# EAGLE design light_controller (EAGLE 8.5.0)
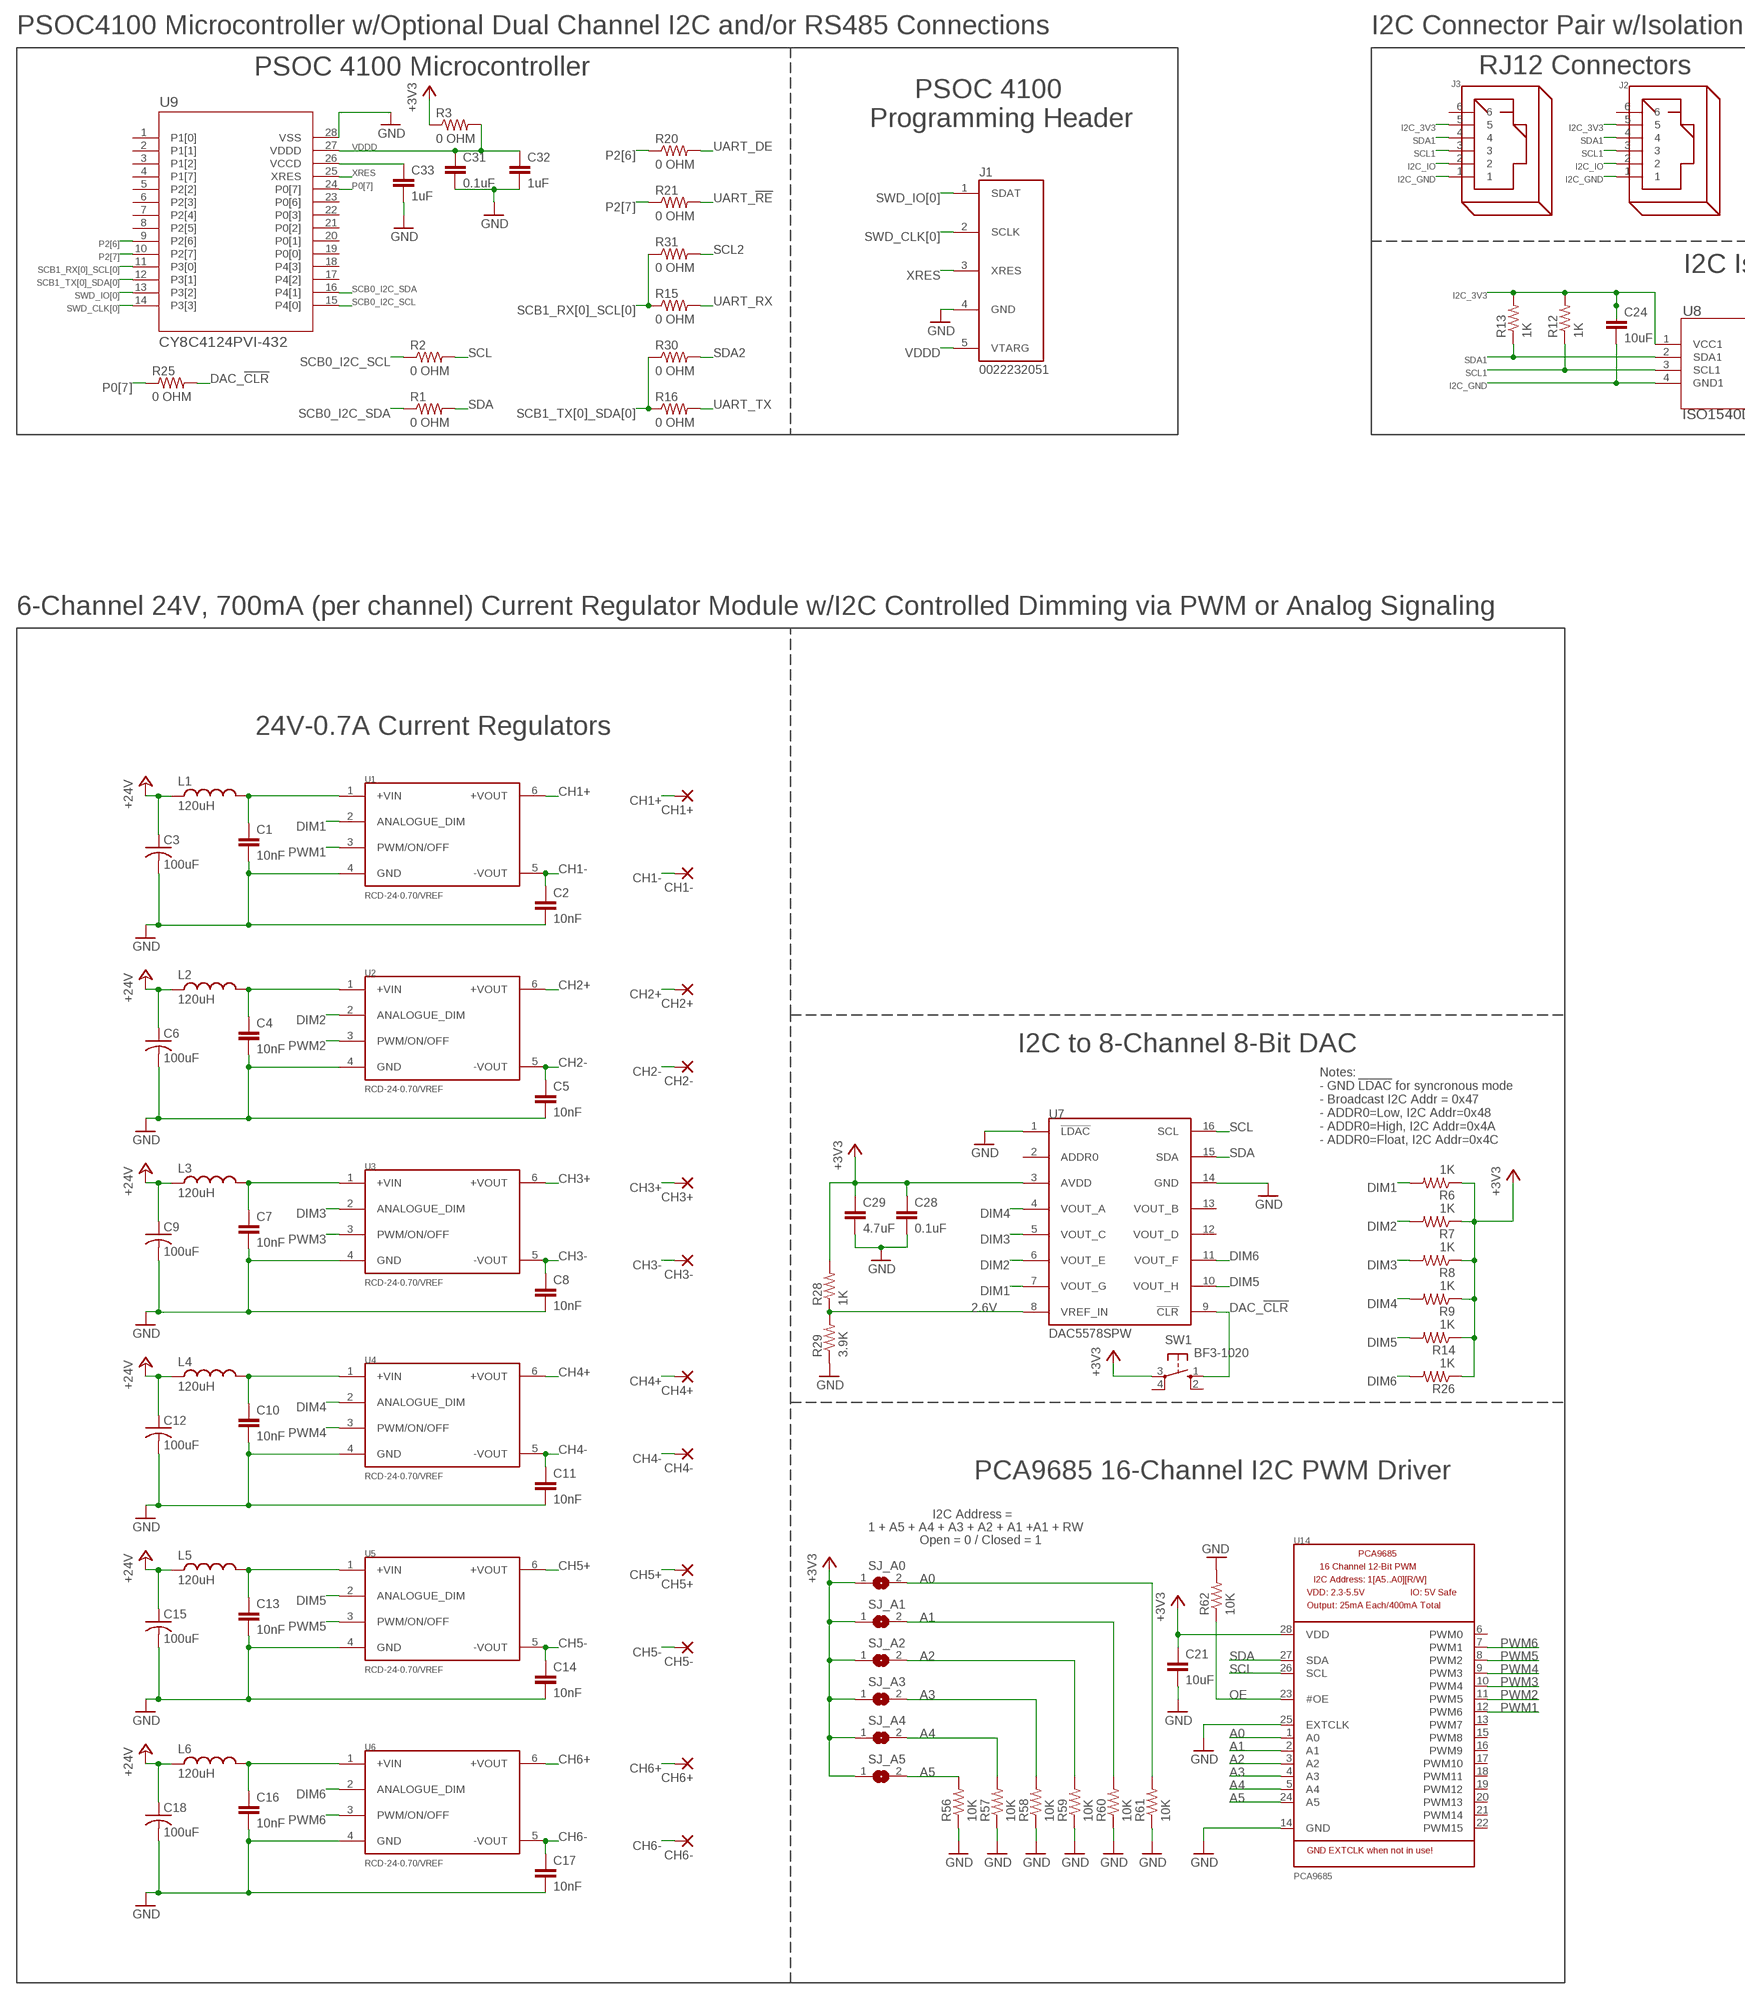
[diagram p0: schematic, sheet 1, part 1 of 2]
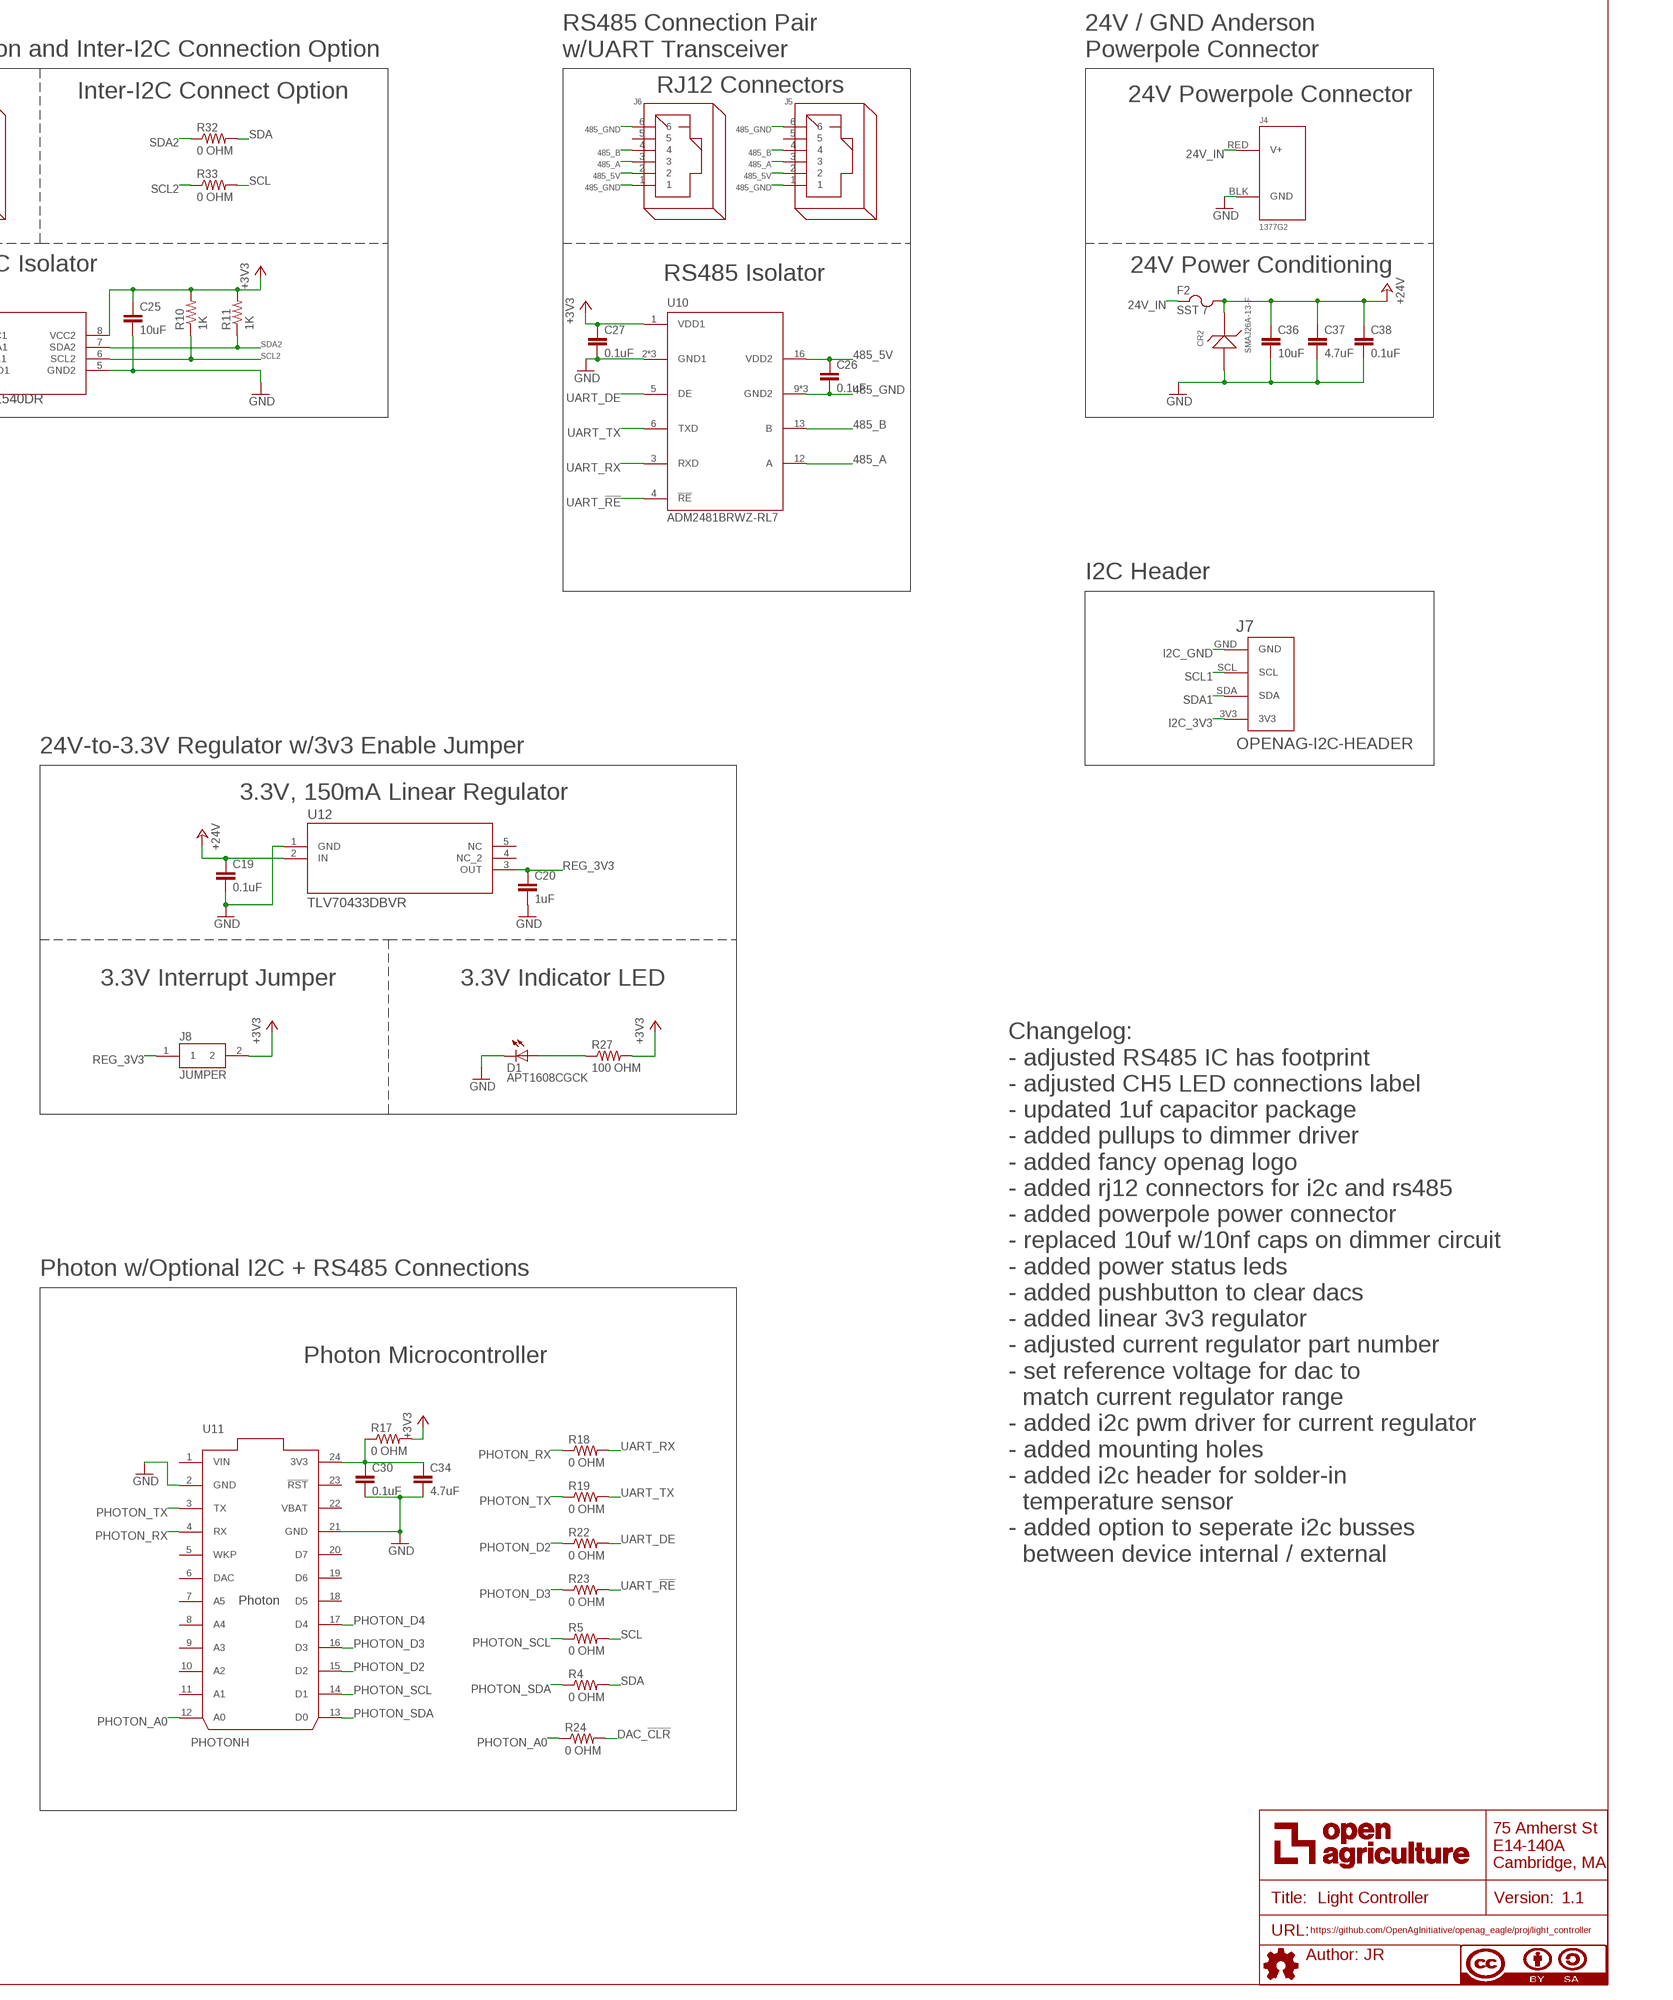
[diagram p1: schematic, sheet 1, part 2 of 2]

## Parts
C1  10nF  10NF-C0603C103K5RACTU  [C0603]
C2  10nF  10NF-C0603C103K5RACTU  [C0603]
C3  100uF  100UF-EEE-1HA101UP  [EEE-1HA101UP]
C4  10nF  10NF-C0603C103K5RACTU  [C0603]
C5  10nF  10NF-C0603C103K5RACTU  [C0603]
C6  100uF  100UF-EEE-1HA101UP  [EEE-1HA101UP]
C7  10nF  10NF-C0603C103K5RACTU  [C0603]
C8  10nF  10NF-C0603C103K5RACTU  [C0603]
C9  100uF  100UF-EEE-1HA101UP  [EEE-1HA101UP]
C10  10nF  10NF-C0603C103K5RACTU  [C0603]
C11  10nF  10NF-C0603C103K5RACTU  [C0603]
C12  100uF  100UF-EEE-1HA101UP  [EEE-1HA101UP]
C13  10nF  10NF-C0603C103K5RACTU  [C0603]
C14  10nF  10NF-C0603C103K5RACTU  [C0603]
C15  100uF  100UF-EEE-1HA101UP  [EEE-1HA101UP]
C16  10nF  10NF-C0603C103K5RACTU  [C0603]
C17  10nF  10NF-C0603C103K5RACTU  [C0603]
C18  100uF  100UF-EEE-1HA101UP  [EEE-1HA101UP]
C19  0.1uF  0.1UF-C0603C104K5RACTU  [C0603]
C20  1uF  1UF-CL10A105KB8NNNC  [C0603]
C21  10uF  10UF-GMK212BBJ106KG-T  [C0805]
C24  10uF  10UF-GMK212BBJ106KG-T  [C0805]
C25  10uF  10UF-GMK212BBJ106KG-T  [C0805]
C26  0.1uF  0.1UF-C0603C104K5RACTU  [C0603]
C27  0.1uF  0.1UF-C0603C104K5RACTU  [C0603]
C28  0.1uF  0.1UF-C0603C104K5RACTU  [C0603]
C29  4.7uF  4.7UF-CL21A475KBQNNNE  [C0805]
C30  0.1uF  0.1UF-C0603C104K5RACTU  [C0603]
C31  0.1uF  0.1UF-C0603C104K5RACTU  [C0603]
C32  1uF  1UF-CL10A105KB8NNNC  [C0603]
C33  1uF  1UF-CL10A105KB8NNNC  [C0603]
C34  4.7uF  4.7UF-CL21A475KBQNNNE  [C0805]
C36  10uF  10UF-GMK212BBJ106KG-T  [C0805]
C37  4.7uF  4.7UF-CL21A475KBQNNNE  [C0805]
C38  0.1uF  0.1UF-C0603C104K5RACTU  [C0603]
CH1+  3,17/1,3  [3,17/1,3]
CH1-  3,17/1,3  [3,17/1,3]
CH2+  3,17/1,3  [3,17/1,3]
CH2-  3,17/1,3  [3,17/1,3]
CH3+  3,17/1,3  [3,17/1,3]
CH3-  3,17/1,3  [3,17/1,3]
CH4+  3,17/1,3  [3,17/1,3]
CH4-  3,17/1,3  [3,17/1,3]
CH5+  3,17/1,3  [3,17/1,3]
CH5-  3,17/1,3  [3,17/1,3]
CH6+  3,17/1,3  [3,17/1,3]
CH6-  3,17/1,3  [3,17/1,3]
CR2  SMAJ26A-13-F  [SMA]
D1  APT1608CGCK  [CHIPLED_0603]
F2  SST 7  SST_7  [SS]
FRAME1  DOCFIELD  [DOCFIELD]
J1  0022232051  MINI-PROG3-5POS-MATING-CONNECTOR  [22-23-2051]
J2  OPENAG-I2C-RJ12  [OPENAG-I2C-RJ12]
J3  OPENAG-I2C-RJ12  [OPENAG-I2C-RJ12]
J4  1377G2  1377G21377G2  [1377G2]
J5  OPENAG-RS485-RJ12  [OPENAG-RS485-RJ12]
J6  OPENAG-RS485-RJ12  [OPENAG-RS485-RJ12]
J7  OPENAG-I2C-HEADER  [OPENAG-I2C-HEADER]
J8  JUMPER  100-MIL-HEADER-JUMPER  [1X2-100-MIL-HEADER]
L1  120uH  120UH-74404064121  [74404064121]
L2  120uH  120UH-74404064121  [74404064121]
L3  120uH  120UH-74404064121  [74404064121]
L4  120uH  120UH-74404064121  [74404064121]
L5  120uH  120UH-74404064121  [74404064121]
L6  120uH  120UH-74404064121  [74404064121]
R1  0 OHM  0OHM-RC0603JR-070RL  [RC0603N]
R2  0 OHM  0OHM-RC0603JR-070RL  [RC0603N]
R3  0 OHM  0OHM-RC0603JR-070RL  [RC0603N]
R4  0 OHM  0OHM-RC0603JR-070RL  [RC0603N]
R5  0 OHM  0OHM-RC0603JR-070RL  [RC0603N]
R6  1K  1K-ERJ-PB3D1001V  [RC0603N]
R7  1K  1K-ERJ-PB3D1001V  [RC0603N]
R8  1K  1K-ERJ-PB3D1001V  [RC0603N]
R9  1K  1K-ERJ-PB3D1001V  [RC0603N]
R10  1K  1K-ERJ-PB3D1001V  [RC0603N]
R11  1K  1K-ERJ-PB3D1001V  [RC0603N]
R12  1K  1K-ERJ-PB3D1001V  [RC0603N]
R13  1K  1K-ERJ-PB3D1001V  [RC0603N]
R14  1K  1K-ERJ-PB3D1001V  [RC0603N]
R15  0 OHM  0OHM-RC0603JR-070RL  [RC0603N]
R16  0 OHM  0OHM-RC0603JR-070RL  [RC0603N]
R17  0 OHM  0OHM-RC0603JR-070RL  [RC0603N]
R18  0 OHM  0OHM-RC0603JR-070RL  [RC0603N]
R19  0 OHM  0OHM-RC0603JR-070RL  [RC0603N]
R20  0 OHM  0OHM-RC0603JR-070RL  [RC0603N]
R21  0 OHM  0OHM-RC0603JR-070RL  [RC0603N]
R22  0 OHM  0OHM-RC0603JR-070RL  [RC0603N]
R23  0 OHM  0OHM-RC0603JR-070RL  [RC0603N]
R24  0 OHM  0OHM-RC0603JR-070RL  [RC0603N]
R25  0 OHM  0OHM-RC0603JR-070RL  [RC0603N]
R26  1K  1K-ERJ-PB3D1001V  [RC0603N]
R27  100 OHM  100OHM-RC0603JR-07100RL  [RC0603N]
R28  1K  1K-ERJ-PB3D1001V  [RC0603N]
R29  3.9K  3.9K-RC0603JR-073K9L  [RC0603N]
R30  0 OHM  0OHM-RC0603JR-070RL  [RC0603N]
R31  0 OHM  0OHM-RC0603JR-070RL  [RC0603N]
R32  0 OHM  0OHM-RC0603JR-070RL  [RC0603N]
R33  0 OHM  0OHM-RC0603JR-070RL  [RC0603N]
R56  10K  10K-ERJ-3EKF1002V  [RC0603N]
R57  10K  10K-ERJ-3EKF1002V  [RC0603N]
R58  10K  10K-ERJ-3EKF1002V  [RC0603N]
R59  10K  10K-ERJ-3EKF1002V  [RC0603N]
R60  10K  10K-ERJ-3EKF1002V  [RC0603N]
R61  10K  10K-ERJ-3EKF1002V  [RC0603N]
R62  10K  10K-ERJ-3EKF1002V  [RC0603N]
SJ_A0  SOLDERJUMPERREFLOW_NOPASTE  [SOLDERJUMPER_REFLOW_NOPASTE]
SJ_A1  SOLDERJUMPERREFLOW_NOPASTE  [SOLDERJUMPER_REFLOW_NOPASTE]
SJ_A2  SOLDERJUMPERREFLOW_NOPASTE  [SOLDERJUMPER_REFLOW_NOPASTE]
SJ_A3  SOLDERJUMPERREFLOW_NOPASTE  [SOLDERJUMPER_REFLOW_NOPASTE]
SJ_A4  SOLDERJUMPERREFLOW_NOPASTE  [SOLDERJUMPER_REFLOW_NOPASTE]
SJ_A5  SOLDERJUMPERREFLOW_NOPASTE  [SOLDERJUMPER_REFLOW_NOPASTE]
SW1  BF3-1020  [B3F-10XX]
U1  RCD-24-0.70/VREF  [RCD-24-PINNED]
U2  RCD-24-0.70/VREF  [RCD-24-PINNED]
U3  RCD-24-0.70/VREF  [RCD-24-PINNED]
U4  RCD-24-0.70/VREF  [RCD-24-PINNED]
U5  RCD-24-0.70/VREF  [RCD-24-PINNED]
U6  RCD-24-0.70/VREF  [RCD-24-PINNED]
U7  DAC5578SPW  [TSSOP16]
U8  ISO1540DR  [D8]
U9  CY8C4124PVI-432  [SSOP-28]
U10  ADM2481BRWZ-RL7  [SOIC16LWB]
U11  PHOTONH  PHOTONHPHOTONH  [PHOTON]
U12  TLV70433DBVR  TLV70433DBVRDBV5-M  [DBV5-M]
U14  PCA9685  PCA9685PW/Q900,118  [TSSOP28]

## Nets
2.6V: R28.1 R29.2 U7.8(VREF_IN)
24V_IN: F2.1 J4.RED(V+)
485_5V: C26.1 J5.2 J6.2 U10.16(VDD2)
485_A: J5.3 J6.3 U10.12(A)
485_B: J5.4 J6.4 U10.13(B)
485_GND: C26.2 J5.1 J5.6 J6.1 J6.6 U10.9(GND2) U10.10(GND2) U10.15(GND2)
+3V3: C21.1 C25.1 C27.1 C28.1 C29.1 J8.2 R3.1 R6.1 R7.1 R8.1 R9.1 R10.2 R11.2 R14.1 R17.2 R26.1 R27.2 R28.2 SJ_A0.1 SJ_A1.1 SJ_A2.1 SJ_A3.1 SJ_A4.1 SJ_A5.1 SW1.3(P) U7.3(AVDD) U8.8(VCC2) U10.1(VDD1) U14.28(VDD)
+24V: C3.+(1(+)) C6.+(1(+)) C9.+(1(+)) C12.+(1(+)) C15.+(1(+)) C18.+(1(+)) C19.1 C36.1 C37.1 C38.1 CR2.1 F2.2 L1.1 L2.1 L3.1 L4.1 L5.1 L6.1 U12.2(IN)
A0: R61.2 SJ_A0.2 U14.1(A0)
A1: R60.2 SJ_A1.2 U14.2(A1)
A2: R59.2 SJ_A2.2 U14.3(A2)
A3: R58.2 SJ_A3.2 U14.4(A3)
A4: R57.2 SJ_A4.2 U14.5(A4)
A5: R56.2 SJ_A5.2 U14.24(A5)
CH1+: CH1+.1(P) U1.6(+VOUT)
CH1-: C2.1 CH1-.1(P) U1.5(-VOUT)
CH2+: CH2+.1(P) U2.6(+VOUT)
CH2-: C5.1 CH2-.1(P) U2.5(-VOUT)
CH3+: CH3+.1(P) U3.6(+VOUT)
CH3-: C8.1 CH3-.1(P) U3.5(-VOUT)
CH4+: CH4+.1(P) U4.6(+VOUT)
CH4-: C11.1 CH4-.1(P) U4.5(-VOUT)
CH5+: CH5+.1(P) U5.6(+VOUT)
CH5-: C14.1 CH5-.1(P) U5.5(-VOUT)
CH6+: CH6+.1(P) U6.6(+VOUT)
CH6-: C17.1 CH6-.1(P) U6.5(-VOUT)
DAC_!CLR!: R24.2 R25.2 SW1.1(S) U7.9(!CLR!)
DIM1: R6.2 U1.2(ANALOGUE_DIM) U7.7(VOUT_G)
DIM2: R7.2 U2.2(ANALOGUE_DIM) U7.6(VOUT_E)
DIM3: R8.2 U3.2(ANALOGUE_DIM) U7.5(VOUT_C)
DIM4: R9.2 U4.2(ANALOGUE_DIM) U7.4(VOUT_A)
DIM5: R14.2 U5.2(ANALOGUE_DIM) U7.10(VOUT_H)
DIM6: R26.2 U6.2(ANALOGUE_DIM) U7.11(VOUT_F)
GND: C1.2 C2.2 C3.-(2(-)) C4.2 C5.2 C6.-(2(-)) C7.2 C8.2 C9.-(2(-)) C10.2 C11.2 C12.-(2(-)) C13.2 C14.2 C15.-(2(-)) C16.2 C17.2 C18.-(2(-)) C19.2 C20.2 C21.2 C25.2 C27.2 C28.2 C29.2 C30.2 C31.2 C32.2 C33.2 C34.2 C36.2 C37.2 C38.2 CR2.2 D1.C J1.4(GND) J4.BLK(GND) R29.1 R56.1 R57.1 R58.1 R59.1 R60.1 R61.1 R62.2 U1.4(GND) U2.4(GND) U3.4(GND) U4.4(GND) U5.4(GND) U6.4(GND) U7.1(!LDAC!) U7.14(GND) U8.5(GND2) U9.28(VSS) U10.2(GND1) U10.7(GND1) U10.8(GND1) U11.2(GND) U11.21(GND) U12.1(GND) U14.14(GND) U14.25(EXTCLK)
I2C_3V3: C24.1 J2.5 J3.5 J7.3V3 R12.2 R13.2 U8.1(VCC1)
I2C_GND: C24.2 J2.1 J3.1 J7.GND U8.4(GND1)
I2C_IO: J2.2 J3.2
N$1: C1.1 L1.2 U1.1(+VIN)
N$2: C4.1 L2.2 U2.1(+VIN)
N$3: D1.A R27.1
N$4: C7.1 L3.2 U3.1(+VIN)
N$5: C10.1 L4.2 U4.1(+VIN)
N$6: C13.1 L5.2 U5.1(+VIN)
N$7: C16.1 L6.2 U6.1(+VIN)
N$8: C30.1 C34.1 R17.1 U11.24(3V3)
N$23: C33.1 U9.26(VCCD)
OE: R62.1 U14.23(#OE)
P0[7]: R25.1 U9.24(P0[7])
P2[6]: R20.1 U9.9(P2[6])
P2[7]: R21.1 U9.10(P2[7])
PHOTON_A0: R24.1 U11.12(A0)
PHOTON_D2: R22.1 U11.15(D2)
PHOTON_D3: R23.1 U11.16(D3)
PHOTON_D4: U11.17(D4)
PHOTON_RX: R18.1 U11.4(RX)
PHOTON_SCL: R5.1 U11.14(D1)
PHOTON_SDA: R4.1 U11.13(D0)
PHOTON_TX: R19.1 U11.3(TX)
PWM1: U1.3(PWM/ON/OFF) U14.12(PWM6)
PWM2: U2.3(PWM/ON/OFF) U14.11(PWM5)
PWM3: U3.3(PWM/ON/OFF) U14.10(PWM4)
PWM4: U4.3(PWM/ON/OFF) U14.9(PWM3)
PWM5: U5.3(PWM/ON/OFF) U14.8(PWM2)
PWM6: U6.3(PWM/ON/OFF) U14.7(PWM1)
REG_3V3: C20.1 J8.1 U12.3(OUT)
SCB0_I2C_SCL: R2.1 U9.15(P4[0])
SCB0_I2C_SDA: R1.1 U9.16(P4[1])
SCB1_RX[0]_SCL[0]: R15.1 R31.1 U9.11(P3[0])
SCB1_TX[0]_SDA[0]: R16.1 R30.1 U9.12(P3[1])
SCL: R2.2 R5.2 R33.2 U7.16(SCL) U14.26(SCL)
SCL1: J2.3 J3.3 J7.SCL R12.1 U8.3(SCL1)
SCL2: R10.1 R31.2 R33.1 U8.6(SCL2)
SDA: R1.2 R4.2 R32.2 U7.15(SDA) U14.27(SDA)
SDA1: J2.4 J3.4 J7.SDA R13.1 U8.2(SDA1)
SDA2: R11.1 R30.2 R32.1 U8.7(SDA2)
SWD_CLK[0]: J1.2(SCLK) U9.14(P3[3])
SWD_IO[0]: J1.1(SDAT) U9.13(P3[2])
UART_!RE!: R21.2 R23.2 U10.4(!RE!)
UART_DE: R20.2 R22.2 U10.5(DE)
UART_RX: R15.2 R18.2 U10.3(RXD)
UART_TX: R16.2 R19.2 U10.6(TXD)
VDDD: C31.1 C32.1 J1.5(VTARG) R3.2 U9.27(VDDD)
XRES: J1.3(XRES) U9.25(XRES)
Unconnected: J2.6 J3.6 J5.5 J6.5 SW1.2(S1) SW1.4(P1) U7.2(ADDR0) U7.12(VOUT_D) U7.13(VOUT_B) U9.1(P1[0]) U9.2(P1[1]) U9.3(P1[2]) U9.4(P1[7]) U9.5(P2[2]) U9.6(P2[3]) U9.7(P2[4]) U9.8(P2[5]) U9.17(P4[2]) U9.18(P4[3]) U9.19(P0[0]) U9.20(P0[1]) U9.21(P0[2]) U9.22(P0[3]) U9.23(P0[6]) U11.5(WKP) U11.6(DAC) U11.7(A5) U11.8(A4) U11.9(A3) U11.10(A2) U11.11(A1) U11.18(D5) U11.19(D6) U11.20(D7) U11.23(!RST) U12.4(NC_2) U12.5(NC) U14.6(PWM0) U14.13(PWM7) U14.15(PWM8) U14.16(PWM9) U14.17(PWM10) U14.18(PWM11) U14.19(PWM12) U14.20(PWM13) U14.21(PWM14) U14.22(PWM15)

## Notes on the sheet
- PSOC4100 Microcontroller w/Optional Dual Channel I2C and/or RS485 Connections | I2C Connector Pair w/Isolation and Inter-I2C Connection Option
- RS485 Connection Pair 
  w/UART Transceiver
- 24V / GND Anderson
  Powerpole Connector
- PSOC 4100 Microcontroller | RJ12 Connectors | Inter-I2C Connect Option | RJ12 Connectors
- 24V Powerpole Connector
- PSOC 4100 
  Programming Header
- I2C Isolator | 24V Power Conditioning
- RS485 Isolator
- 6-Channel 24V, 700mA (per channel) Current Regulator Module w/I2C Controlled Dimming via PWM or Analog Signaling | I2C Header
- 24V-0.7A Current Regulators
- 24V-to-3.3V Regulator w/3v3 Enable Jumper
- 3.3V, 150mA Linear Regulator
- I2C to 8-Channel 8-Bit DAC
- 3.3V Interrupt Jumper | 3.3V Indicator LED
- Notes:
  - GND !LDAC! for syncronous mode
  - Broadcast I2C Addr = 0x47
  - ADDR0=Low, I2C Addr=0x48
  - ADDR0=High, I2C Addr=0x4A
  - ADDR0=Float, I2C Addr=0x4C
- Photon w/Optional I2C + RS485 Connections
- PCA9685 16-Channel I2C PWM Driver | Photon Microcontroller
- I2C Address =
- 1 + A5 + A4 + A3 + A2 + A1 +A1 + RW
- Open = 0 / Closed = 1
- Changelog:
  - adjusted RS485 IC has footprint 
  - adjusted CH5 LED connections label
  - updated 1uf capacitor package
  - added pullups to dimmer driver
  - added fancy openag logo
  - added rj12 connectors for i2c and rs485
  - added powerpole power connector
  - replaced 10uf w/10nf caps on dimmer circuit
  - added power status leds
  - added pushbutton to clear dacs
  - added linear 3v3 regulator
  - adjusted current regulator part number
  - set reference voltage for dac to 
    match current regulator range
  - added i2c pwm driver for current regulator
  - added mounting holes
  - added i2c header for solder-in 
    temperature sensor
  - added option to seperate i2c busses 
    between device internal / external

## Power pins joined to a net without a drawn wire
VBAT: U11.22(VBAT)
VIN: U11.1(VIN)

## Library data of the parts
C1 C2 C4 C5 C7 C8 C10 C11 C13 C14 C16 C17 = openag-capacitors:10NF-C0603C103K5RACTU: KEMET - C0603C103K5RACTU - CAP CER 10000PF 50V X7R 0603 Description: 10000pF ±10% 50V Ceramic Capacitor X7R 0603 (1608 Metric) Technical Specifications: Capacitance: 10000pF Tolerance: ±10% Voltage - Rated: 50V Temperature Coefficient: X7R Operating Temperature: -55°C ~ 125°C Applications: General Purpose Mounting Type: Surface Mount, MLCC Package / Case: 0603 (1608 Metric) Size / Dimension: 0.063" L x 0.032" W (1.60mm x 0.80mm) Thickness (Max): 0.034" (0.87mm) Datasheet(s): X7R Dielectric, 6.3-250 VDC <https://search.kemet.com/component-edge/download/datasheet/C0603C103K5RACTU.pdf> Vendor(s): Digikey: 399-1091-1-ND <https://www.digikey.com/product-detail/en/kemet/C0603C103K5RACTU/399-1091-1-ND/411366#>; POPULATE: YES; VERIFIED: NO
C3 C6 C9 C12 C15 C18 = openag-capacitors:100UF-EEE-1HA101UP: Panasonic - EEE-1HA101UP - ELECTROLYTIC CAP ALUM 100UF 20% 50V SMD Description: 100µF 50V Aluminum Electrolytic Capacitors Radial, Can - SMD 2000 Hrs @ 85°C Technical Specifications: Capacitance: 100uF Tolerance: ±20% Rated Voltage: 50V Polarization: Polar Operating Temperature: -40°C ~ 85°C Datasheet(s): S Series, Type V <https://industrial.panasonic.com/cdbs/www-data/pdf/RDE0000/ABA0000C1145.pdf> Vendor(s): Digikey: PCE3917CT-ND <https://www.digikey.com/product-detail/en/panasonic-electronic-components/EEE-1HA101UP/PCE3917CT-ND/766293>; POPULATE: YES; VERIFIED: NO
C19 C26-C28 C30 C31 C38 = openag-capacitors:0.1UF-C0603C104K5RACTU: Kemet - C0603C104K5RACTU - CAP CER 0.1UF 50V X7R 0603 Description: 0.1µF ±10% 50V Ceramic Capacitor X7R 0603 (1608 Metric) Technical Specifications: Capacitance: 0.1µF Tolerance: ±10% Rated Voltage: 50V Temperature Coefficient: X7R Operating Temperature: -55°C ~ 125°C Package / Case: 0603 (1608 Metric) Datasheet(s): X7R Dielectric, 6.3-250 VDC <https://search.kemet.com/component-edge/download/datasheet/C0603C104K5RACTU.pdf> Vendor(s): Digikey: 399-5089-1-ND <https://www.digikey.com/product-detail/en/kemet/C0603C104K5RACTU/399-5089-1-ND/1465623>; POPULATE: YES; VERIFIED: NO
C20 C32 C33 = openag-capacitors:1UF-CL10A105KB8NNNC: Samsung - CL10A105KB8NNNC - CAP CER 1UF 50V X5R 0603 Description: 1µF ±10% 50V Ceramic Capacitor X5R 0603 (1608 Metric) Technical Specifications: Capacitance: 1µF Tolerance: ±10% Rated Voltage: 50V Temperature Coefficient: X5R Operating Temperature: -55°C ~ 85°C Packaging / Case: 0603 (1608 Metric) Datasheet(s): CL10A105KB8NNNC Spec <http://www.samsungsem.com/kr/support/product-search/mlcc/CL10A105KB8NNNC.jsp> Vendor(s): Digikey: 1276-1860-1-ND <https://www.digikey.com/product-detail/en/samsung-electro-mechanics-america-inc/CL10A105KB8NNNC/1276-1860-1-ND/3889946>; POPULATE: YES; VERIFIED: NO
C21 C24 C25 C36 = openag-capacitors:10UF-GMK212BBJ106KG-T: Taiyo Yuden - GMK212BBJ106KG-T - CAP CER 10UF 35V X5R 0805 Description: 10µF ±10% 35V Ceramic Capacitor X5R 0805 (2012 Metric) Technical Specifications: Capacitance: 10µF Tolerance: ±10% Rated Voltage: 35V Temperature Coefficient: X5R Operating Temperature: -55°C ~ 85°C Package / Case: 0805 (2012 Metric) Datasheet(s): GMK212BBJ106KG-T Spec <http://ds.yuden.co.jp/TYCOMPAS/ut/detail.do?productNo=GMK212BBJ106KG-T&fileName=GMK212BBJ106KG-T_SS&mode=specSheetDownload> Vendor(s): Digikey: 587-4893-1-ND <https://www.digikey.com/product-detail/en/taiyo-yuden/GMK212BBJ106KG-T/587-4893-1-ND/6563736>; POPULATE: YES; VERIFIED: NO
C29 C34 C37 = openag-capacitors:4.7UF-CL21A475KBQNNNE: Samsung - CL21A475KBQNNNE - CAP CER 4.7UF 50V X5R 0805 Description: 4.7µF ±10% 50V Ceramic Capacitor X5R 0805 (2012 Metric) Technical Specifications: Capacitance: 4.7uF Tolerance: ±10% Rated Voltage: 50V Temperature Coefficient: X5R Operating Temperature: -55°C ~ 85°C Package/Case: 0805 (2012 Metric) Datasheet(s): CL21A475KBQNNNE Characteristics <http://www.samsungsem.com/kr/front/downloadcms.do?path=/kr/support/product-search/mlcc/__icsFiles/afieldfile/2014/11/05&fileName=C_CL21A475KBQNNNE.pdf> Vendor(s): Digikey: 1276-1248-1-ND <https://www.digikey.com/product-detail/en/samsung-electro-mechanics/CL21A475KBQNNNE/1276-1248-1-ND/3889334>; POPULATE: YES; VERIFIED: NO
CH1+ CH1- CH2+ CH2- CH3+ CH3- CH4+ CH4- CH5+ CH5- CH6+ CH6- = openag-wirepads:3,17/1,3: THROUGH-HOLE PAD
CR2 = openag-diodes:SMAJ26A-13-F: Diodes Incorporated - SMAJ26A-13-F - TVS DIODE 26VWM 42.1VC SMA Description: TVS DIODE 26VWM 42.1VC SMA Technical Specifications: Type: Zener Voltage - Reverse Standoff (Typ): 26V Voltage - Breakdown (Min): 28.9V Voltage - Clamping (Max) @ Ipp: 42.1V Current - Peak Pulse (10/1000µs): 9.5A Power - Peak Pulse: 400W Power Line Protection: No Operating Temperature: -55°C ~ 150°C (TJ) DO-214AC, SMA Datasheet(s): SMAJ5.0(C)A - SMAJ200(C)A Vendor(s): Digikey: SMAJ26A-FDICT-ND <https://www.digikey.com/product-detail/en/diodes-incorporated/SMAJ26A-13-F/SMAJ26A-FDICT-ND/806583>; POPULATE: YES; VERIFIED: NO
D1 = openag-diodes:APT1608CGCK: Kingbright - APT1608CGCK - LED GREEN CLEAR 0603 SMD Description: Green 570nm LED Indication - Discrete 2.1V 0603 (1608 Metric) Technical Specifications: Color: Green Lens Color: Colorless Lens Transparency: Clear Millicandela Rating: 50mcd Lens Style/Size: Rectangle with Flat Top, 1.20mm x 0.80mm Voltage - Forward (Vf) (Typ): 2.1V Current - Test: 20mA Viewing Angle: 120° Mounting Type: Surface Mount Wavelength - Dominant: 570nm Wavelength - Peak: 574nm Package / Case: 0603 (1608 Metric) Supplier Device Package: Chip LED Size / Dimension: 1.60mm L x 0.80mm W Height (Max): 0.75mm Datasheet(s): APT1608CGCK <http://www.kingbrightusa.com/images/catalog/SPEC/APT1608CGCK.pdf> Vendor(s): Digikey: 754-1116-1-ND <https://www.digikey.com/product-detail/en/kingbright/APT1608CGCK/754-1116-1-ND/1747833#>; POPULATE: YES; VERIFIED: NO
F2 = openag-fuses:SST_7: Bel Fuse - SST7 - FUSE BRD MNT 7A 125VAC/VDC 2SMD Description: FUSE BRD MNT 7A 125VAC/VDC 2SMD Technical Specifications: Current Rating: 7A Voltage Rating: 125V Fuse Type: Board Mount (Cartridge Style Excluded) Mounting Type: Surface Mount Operating Temperature: -55°C ~ 125°C Datasheet(s): SST Type <https://belfuse.com/resources/StewartConnector/SST.pdf> Vendor(s): Digikey: 507-1072-1-ND <https://www.digikey.com/product-detail/en/bel-fuse-inc/SST-7/507-1072-1-ND/615026>; POPULATE: YES; VERIFIED: NO
FRAME1 = openag-frames:DOCFIELD: DOCUMENT FIELD; AUTHOR: JR; DESCRIPTION: Controls 6 channels of 24V, 700mA for LED strings that can be interfaced via i2c, rs485, and/or wifi.; TITLE: Light Controller; URL: https://github.com/OpenAgInitiative/openag_eagle/proj/light_controller; VER: 1.1
J1 = openag-connectors:MINI-PROG3-5POS-MATING-CONNECTOR: Molex - 0022232051 - CONN HEADER 5POS .100 VERT TIN Description: 5 Positions Header Connector 0.100" (2.54mm) Through Hole Tin This is the specified mating connector for programming a PSOC microcontroller with the MiniProg3 Programmer Technical Specifications: Connector Type: Header Contact Type: Male Pin Pitch - Mating: 0.100" (2.54mm) Number of Positions: 5 Number of Rows: 1 Mounting Type: Through Hole Fastening Type: Friction Lock Datasheet(s): Molex 22-23-2051 <http://www.molex.com/pdm_docs/sd/022232051_sd.pdf> Cypress CY8CKIT-002 Brief <http://www.cypress.com/file/44091/download> Vendor(s): Digikey: WM4203-ND (Molex Connector) <https://www.digikey.com/products/en?keywords=22-23-2051> Digikey: 428-2975-ND (Cypress Programmer Kit) <https://www.digikey.com/product-detail/en/cypress-semiconductor-corp/CY8CKIT-002/428-2975-ND/2126344>; POPULATE: YES; VERIFIED: NO
J2 J3 = openag-connectors:OPENAG-I2C-RJ12: Assmann WSW Components - A-2004-1-4-LP-N-R - RJ12 CONN MOD JACK 6P6C R/A UNSHLD Description: Jack Modular Connector 6p6c (RJ11, RJ12, RJ14, RJ25) 90° Angle (Right) Unshielded Technical Specifications: Connector Type: Jack Number of Positions/Contacts: 6p6c (RJ11, RJ12, RJ14, RJ25) Number of Ports: 1 Number of Rows: 1 Mounting Type: Through Hole Orientation: 90° Angle (Right) Termination: Solder Shielding: Unshielded Features: Board Lock LED Color: Does Not Contain LED Tab Direction: Down Contact Material: Phosphor Bronze Contact Finish: Gold Contact Finish Thickness: 6µin (0.152µm) Housing Material: Polybutylene Terephthalate (PBT), Glass Filled Operating Temperature: -40°C ~ 85°C Datasheet(s): A-2004-1-4-LP-N Drawing <http://www.assmann-wsw.com/fileadmin/datasheets/ASS_7320_CO.pdf> Vendor(s): Digikey: AE10383-ND <https://www.digikey.com/product-detail/en/assmann-wsw-components/A-2004-1-4-LP-N-R/AE10383-ND/2183634>; MPN: A-2004-1-4-LP-N-R
J4 = openag-connectors:1377G2: Anderson Powerpole - 1377G2 - RT. ANGLE 25A THRU-HOLE PCB CONTACT PAIR FOR 15/45 HOUSING Description: Heavy Duty Power Connectors PP PCB .40/1.295 RT.ANG.CONT. short one Technical Specifications: Current Rating: 25A Voltage Rating: 600 V Datasheet(s): 1377G2 Datasheet <http://www.mouser.com/ds/2/22/ds-pp1545-766098.pdf> Vendor(s): Mouser: 879-1377G2 <https://www.mouser.com/ProductDetail/Anderson-Power-Products/1377G2/?qs=sGAEpiMZZMtjzVbpKqo2YZRH3O%252bLIhj7rfgcv2%2febyE%3d>; POPULATE: YES; VERIFIED: NO
J5 J6 = openag-connectors:OPENAG-RS485-RJ12: Assmann WSW Components - A-2004-1-4-LP-N-R - RJ12 CONN MOD JACK 6P6C R/A UNSHLD Description: Jack Modular Connector 6p6c (RJ11, RJ12, RJ14, RJ25) 90° Angle (Right) Unshielded Technical Specifications: Connector Type: Jack Number of Positions/Contacts: 6p6c (RJ11, RJ12, RJ14, RJ25) Number of Ports: 1 Number of Rows: 1 Mounting Type: Through Hole Orientation: 90° Angle (Right) Termination: Solder Shielding: Unshielded Features: Board Lock LED Color: Does Not Contain LED Tab Direction: Down Contact Material: Phosphor Bronze Contact Finish: Gold Contact Finish Thickness: 6µin (0.152µm) Housing Material: Polybutylene Terephthalate (PBT), Glass Filled Operating Temperature: -40°C ~ 85°C Datasheet(s): A-2004-1-4-LP-N Drawing <http://www.assmann-wsw.com/fileadmin/datasheets/ASS_7320_CO.pdf> Vendor(s): Digikey: AE10383-ND <https://www.digikey.com/product-detail/en/assmann-wsw-components/A-2004-1-4-LP-N-R/AE10383-ND/2183634>
J7 = openag-connectors:OPENAG-I2C-HEADER: Fits standard 100 mil header footprint; POPULATE: NO; VERIFIED: NO
J8 = openag-connectors:100-MIL-HEADER-JUMPER; POPULATE: YES; VERIFIED: NO
L1-L6 = openag-inductors:120UH-74404064121: Wurth Electronics - 74404064121 - FIXED IND 120UH 790MA 520 MOHM Technical Specifications: Inductance: 120uH Rated Current: 790mA Saturation Current: 980mA DC Resistance: 520mΩ Operating Temperature: -40° C to 125°C Datasheet(s): 74404064121 Drawing <http://katalog.we-online.de/pbs/datasheet/74404064121.pdf> Vendors: Digikey: 732-7258-1-ND <https://www.digikey.com/product-detail/en/wurth-electronics-inc/74404064121/732-7258-1-ND/5353238>; POPULATE: YES; VERIFIED: NO
R1-R5 R15-R25 R30-R33 = openag-resistors:0OHM-RC0603JR-070RL: Yageo - RC0603JR-070RL - RES SMD 0 OHM JUMPER 1/10W 0603 Description: 0 Ohms Jumper 0.1W, 1/10W Chip Resistor 0603 (1608 Metric) Moisture Resistant Thick Film Technical Specifications: Resistance: 0 Ohms Power: 0.1W, 1/10W Operating Temperature: -55°C ~ 155°C Package / Case: 0603 (1608 Metric) Datasheet(s): RC Series, L Datasheet <http://www.yageo.com/documents/recent/PYu-RC_Group_51_RoHS_L_8.pdf> Vendor(s): Digikey: 311-0.0GRCT-ND <https://www.digikey.com/product-detail/en/yageo/RC0603JR-070RL/311-0.0GRCT-ND/729622>; POPULATE: YES; VERIFIED: NO
R6-R14 R26 R28 = openag-resistors:1K-ERJ-PB3D1001V: Panasonic - P20283CT-ND - RES SMD 1K OHM 0.5% 1/5W 0603 Description: 1 kOhms ±0.5% 0.2W, 1/5W Chip Resistor 0603 (1608 Metric) Automotive AEC-Q200, Pulse Withstanding Thick Film Technical Specifications: Resistance: 1 kOhms Tolerance: ±0.5% Power: 0.2W, 1/5W Operating Temperature: -55°C ~ 155°C Package / Case: 0603 (1608 Metric) Datasheet(s): ERJ-PB3, PB6 Series, High Precision Datasheet <https://industrial.panasonic.com/cdbs/www-data/pdf/RDM0000/AOA0000C328.pdf> Vendor(s): Digikey: P20283CT-ND <https://www.digikey.com/product-detail/en/panasonic-electronic-components/ERJ-PB3D1001V/P20283CT-ND/6214538>; POPULATE: YES; VERIFIED: NO
R27 = openag-resistors:100OHM-RC0603JR-07100RL: Yageo - RC0603JR-07100RL - RES SMD 100 OHM 5% 1/10W 0603 Description: 100 Ohms ±5% 0.1W, 1/10W Chip Resistor 0603 (1608 Metric) Moisture Resistant Thick Film Technical Specifications: Resistance: 100 Ohms Tolerance: ±5% Power (Watts): 0.1W, 1/10W Composition: Thick Film Features: Moisture Resistant Temperature Coefficient: ±100ppm/°C Operating Temperature: -55°C ~ 155°C Package / Case: 0603 (1608 Metric) Supplier Device Package: 0603 Size / Dimension: 0.063" L x 0.032" W (1.60mm x 0.80mm) Height - Seated (Max): 0.022" (0.55mm) Number of Terminations: 2 Datasheet(s): Thick Film Chip Resistor Intro <http://www.yageo.com.tw/exep/pages/download/literatures/PYu-R_INT-thick_7.pdf> Chip Resistor Marking <http://www.yageo.com/exep/pages/download/literatures/PYu-R_Marking_2.pdf> RC Series, L Datasheet <http://www.yageo.com/documents/recent/PYu-RC_Group_51_RoHS_L_8.pdf> Vendor(s): Digikey: 311-100GRCT-ND <https://www.digikey.com/product-detail/en/yageo/RC0603JR-07100RL/311-100GRCT-ND/729644>; POPULATE: YES; VERIFIED: NO
R29 = openag-resistors:3.9K-RC0603JR-073K9L: Yageo - RC0603JR-073K9L - RES SMD 3.9K OHM 5% 1/10W 0603 Description: 3.9 kOhms ±5% 0.1W, 1/10W Chip Resistor 0603 (1608 Metric) Moisture Resistant Thick Film Technical Specifications: Resistance: 3.9 kOhms Tolerance: ±5% Power (Watts): 0.1W, 1/10W Composition: Thick Film Features: Moisture Resistant Temperature Coefficient: ±100ppm/°C Operating Temperature: -55°C ~ 155°C Package / Case: 0603 (1608 Metric) Supplier Device Package: 0603 Size / Dimension: 0.063" L x 0.032" W (1.60mm x 0.80mm) Height - Seated (Max): 0.022" (0.55mm) Number of Terminations: 2 Datasheet(s): Thick Film Chip Resistor Intro <http://www.yageo.com.tw/exep/pages/download/literatures/PYu-R_INT-thick_7.pdf> Chip Resistor Marking <http://www.yageo.com/exep/pages/download/literatures/PYu-R_Marking_2.pdf> RC Series, L Datasheet <http://www.yageo.com/documents/recent/PYu-RC_Group_51_RoHS_L_8.pdf> Vendor(s): Digikey: 311-3.9KGRCT-ND <https://www.digikey.com/product-detail/en/yageo/RC0603JR-073K9L/311-3.9KGRCT-ND/729710>; POPULATE: YES; VERIFIED: NO
R56-R62 = openag-resistors:10K-ERJ-3EKF1002V: Panasonic - ERJ-3EKF1002V - RES SMD 10K OHM 1% 1/10W 0603 Description: 10 kOhms ±1% 0.1W, 1/10W Chip Resistor 0603 (1608 Metric) Automotive AEC-Q200 Thick Film Technical Specifications: Resistance: 10kOhms Tolerance: ±1% Power: 0.1W, 1/10W Operating Temperature: -55°C ~ 155°C Package/Case: 0603 (1608 Metric) Datasheet(s): ERJ-3EKF1002V View All Specifications <https://industrial.panasonic.com/ww/products/resistors/chip-resistors/general-purpose-chip-resistors/precision-thick-film-chip-resistors/ERJ3EKF1002V> Vendor(s): Digikey: P10.0KHCT-ND <https://www.digikey.com/product-detail/en/panasonic-electronic-components/ERJ-3EKF1002V/P10.0KHCT-ND/198102>; POPULATE: YES; VERIFIED: NO
SJ_A0 SJ_A1-SJ_A5 = openag-connectors:SOLDERJUMPER: SMD Solder JUMPER Solder the two pads together to create a connection, or remove the solder to break it. REFLOW - Use this footprint for solder paste and reflow ovens. WAVE - Use this footprint for hand-soldering (larger pads). CLOSED - Has a trace between the two pads to ensure it is closed by default. The trace needs to be cut to disable the jumper, and can be closed again by creating a solder bridge between the two pads.; POPULATE: YES; VERIFIED: NO
SW1 = openag-switches:BF3-1020: Omron - BF3-1020 -SWITCH TACTILE SPST-NO 0.05A 24V Description: Tactile Switch SPST-NO Top Actuated Through Hole Technical Specifications: Circuit: SPST-NO Switch Function: Off-Mom Contact Rating @ Voltage: 0.05A @ 24VDC Mounting Type: Through Hole Switch Travel: 0.25mm Mechanical Life: 1,000,000 Cycles Operating Temperature: -25°C ~ 70°C Datasheet(s): B3F Series Datasheet <http://omronfs.omron.com/en_US/ecb/products/pdf/en-b3f.pdf> Vendor(s): Digikey: SW402-ND <https://www.digikey.com/products/en?keywords=B3F-1020>; POPULATE: YES; VERIFIED: NO
U1-U6 = openag-regulators:RCD-24-0.70/VREF: Recom Power - RCD-24-0.70/VREF - LED SUPPLY CC BUCK 2-35V 700MA Description: 700mA 2 ~ 35 V Constant Current LED Driver Buck Topology 1 Output Technical Specifications: Type: Constant Current Topology: Buck Number of Outputs: 1 Voltage - Input (Min): 4.5V Voltage - Input (Max): 36V Voltage - Output: 2 ~ 35 V Current - Output (Max): 700mA Power (Watts): 25W Dimming: Analog Features: SCP Operating Temperature: -40°C ~ 71°C Efficiency: 96% Mounting Type: Through Hole Package / Case: 6-DIP Module Size / Dimension: 0.87" L x 0.49" W x 0.33" H (22.1mm x 12.6mm x 8.5mm) Approvals: cULus Weight: 0.01 lb (4.54g) Datasheet(s): RCD-24 Series Datasheet <https://www.recom-power.com/pdf/Lightline/RCD-24.pdf> Vendor(s): Digikey: 945-1806-5-ND <https://www.digikey.com/product-detail/en/recom-power/RCD-24-0.70-VREF/945-1806-5-ND/2613767>; POPULATE: YES; VERIFIED: NO
U7 = openag-dacs:DAC5578SPW: Texas Instruments - DAC5578SPW Description: 8 Bit Digital to Analog Converter 8 16-TSSOP Technical Specifications: Number of Bits: 8-bit Number of D/A Converters: 8 Settling Time: 12us Operating Voltage: 2.7V - 5.5V Operating Temperature: -40° C to 125°C Max IDD (Normal Mode): 1.4mA Output Short Circuit Current (Individual): 25mA Datasheet(s): DAC5578,6578,7578 <http://www.ti.com/lit/ds/symlink/dac5578.pdf> Vendor(s): Digikey: 296-27736-5-ND <https://www.digikey.com/product-detail/en/texas-instruments/DAC5578SPW/296-27736-5-ND/2360827>; POPULATE: YES; VERIFIED: NO
U8 = openag-isolators:ISO1540DR: Texas Instruments - ISO1540DR - DGTL ISO 2.5KV 2CH I2C 8SOIC Description: I²C Digital Isolator 2500Vrms 2 Channel 1Mbps 25kV/µs CMTI 8-SOIC (0.154", 3.90mm Width) Technical Specifications: Technology: Capacitive Coupling Type: I²C Number of Channels: 2 Channel Type: Bidirectional Voltage-Isolation: 2500Vrms Voltage - Supply: 3 V ~ 5.5 V Data Rate: 1Mbps Operating Temperature: -40°C ~ 125°C Package / Case: 8-SOIC (0.154", 3.90mm Width) Max Supply Current (3V ≤ VCC1, VCC2 ≤ 3.6V) Side 1, Side 2: 3.8mA, 3.1mA Datasheet(s): ISO154x <http://www.ti.com/lit/ds/symlink/iso1540.pdf> Vendor(s): Digikey: 296-34871-1-ND <https://www.digikey.com/product-detail/en/texas-instruments/ISO1540DR/296-34871-1-ND/3587214>; POPULATE: YES; VERIFIED: NO
U9 = openag-microcontrollers:CY8C4124PVI-432: Cypress - CY8C4124PVI-432 - IC MCU 32BIT 16KB FLASH 28SSOP Description: ARM® Cortex®-M0 PSOC® 4 CY8C41xx Microcontroller IC 32-Bit 24MHz 16KB (16K x 8) FLASH 28-SSOP Technical Specifications: Core Processor: ARM® Cortex®-M0 Core Size: 32-Bit Core Speed: 24 MHz Connectivity: I²C, IrDA, LIN, Microwire, SmartCard, SPI, SSP, UART/USART Peripherals: Brown-out Detect/Reset, LVD, POR, PWM, WDT Number of IO: 24 Program Memory Size: 16KB (16K x 8) Program Memory Type: FLASH RAM Size: 4K x 8 Supply Voltage: 1.71 V ~ 5.5 V Data Converters: A/D 8x12b Oscillator Type: Internal Operating Temperature: -40°C ~ 85°C (TA) Package / Case: 28-SSOP (0.209", 5.30mm Width) Datasheet(s): PSoC 4100 Family <http://www.cypress.com/file/138651/download> Vendor(s): Digikey: 428-3348-ND <https://www.digikey.com/product-detail/en/cypress-semiconductor-corp/CY8C4124PVI-432/428-3348-ND/4895074>; POPULATE: YES; VERIFIED: NO
U10 = openag-isolators:ADM2481BRWZ-RL7: Analog Devices - ADM2481BRWZ-RL7 - DGTL ISO RS422/RS485 16SOIC Description: RS422, RS485 Digital Isolator 2500Vrms 3 Channel 500kbps 25kV/µs CMTI 16-SOIC (0.295", 7.50mm Width) Technical Specifications: Technology: Magnetic Coupling Type: RS422, RS485 Isolated Power: No Number of Channels: 3 Inputs - Side 1/Side 2: 2/1 Channel Type: Bidirectional Voltage - Isolation: 2500Vrms Common Mode Transient Immunity (Min): 25kV/µs Data Rate: 500kbps Rise / Fall Time (Typ): 600ns, 600ns (Max) Supply Voltage: 3.3 V ~ 5 V Operating Temperature: -40°C ~ 85°C Package / Case: 16-SOIC (0.295", 7.50mm Width) Datasheet(s): ADM2481 <http://www.analog.com/media/en/technical-documentation/data-sheets/ADM2481.pdf> Vendor(s): Digikey: ADM2481BRWZ-RL7TR-ND <https://www.digikey.com/product-detail/en/analog-devices-inc/ADM2481BRWZ-RL7/ADM2481BRWZ-RL7TR-ND/2606655>
U11 = openag-microcontrollers:PHOTONH: PARTICLE - PHOTONH - Tiny Wi-Fi dev board w/cloud backend Description: The Photon is a $19 tiny Wi-Fi development kit for creating connected projects and products for the Internet of Things. It's easy to use, it's powerful, and it's connected to the cloud. Technical Specifications: Processor: STM32F205RGY6 120Mhz ARM Cortex M3 Wireless: 802.11b/g/n Wi-Fi Peripherals: Digital(x18), ADC(x8), DAC(x2), SPI(x2), I2S(x1), I2C(x1) SPI, CAN(1), USB(1), PWM(9) Memory: 1MB flash, 128KB RAM Cerfifications: FCC, CE and IC Operating Temperature: -20°C ~ 60°C Humidity Range: Non condensing, relative humidity: 95% Supply Input Voltage (VIN): 3.6V ~ 5.5V Supply Input Voltage (3V3): 3.0V ~ 3.6V Max Supply Output Current (VIN): 1A Max Supply Output Current (3V3): 100mA Average Operating Current (WiFi on, @VIN): up to 100mA Peak Operating Current (WiFi on, @VIN): up to 430mA I/O Max Source/Sink Current (Individual): 25mA I/O Max Source/Sinnk Current (Total): 120mA Datasheet(s): Photon Datasheet <https://docs.particle.io/datasheets/photon-datasheet/> Vendor(s): Particle: PHOTONH <https://store.particle.io/products/photon>; POPULATE: YES; VERIFIED: NO
U12 = openag-regulators:TLV70433DBVR: Texas Instruments - TLV70433DBVR - IC REG LINEAR 3.3V 150MA SOT23-5 Description: Linear Voltage Regulator IC Positive Fixed 1 Output 3.3V 150mA SOT-23-5 Technical Specifications: Output Configuration: Positive Output Type: Fixed Number of Regulators: 1 Voltage - Input (Max): 24V Voltage - Output (Min/Fixed): 3.3V Voltage Dropout (Max): 1.1V @ 100mA Current - Output: 150mA Current - Quiescent (Iq): 4.5µA Current - Supply (Max): 5.5µA PSRR: 60dB (100kHz) Protection Features: Over Current, Reverse Polarity Operating Temperature: -40°C ~ 125°C Mounting Type: Surface Mount Package / Case: SC-74A, SOT-753 Supplier Device Package: SOT-23-5 Datasheet(s): TLV704xx <http://www.ti.com/lit/ds/symlink/tlv704.pdf> Vendor(s): Digikey: 296-39285-1-ND <https://www.digikey.com/product-detail/en/texas-instruments/TLV70433DBVR/296-39285-1-ND/5143276>; POPULATE: YES; VERIFIED: NO
U14 = openag-pwm:PCA9685PW/Q900,118: NXP USA Inc. - PCA9685PW/Q900,118 - IC LED DRVR LIN DIM 25MA 28TSSOP Description: LED Driver IC 16 Output Linear PWM Dimming 25mA 28-TSSOP Technical Specifications: Type: Linear Internal Switch(s): Yes Number of Outputs: 16 Voltage - Supply (Min): 2.3V Voltage - Supply (Max): 5.5V Voltage - Output: 5.5V Current - Output / Channel: 25mA Dimming: PWM Applications: Backlight Operating Temperature: -40°C ~ 85°C (TA) Mounting Type: Surface Mount Package / Case: 28-TSSOP (0.173", 4.40mm Width) Supplier Device Package: 28-TSSOP Base Part Number: PCA9685 Datasheet(s): LED Controllers Leaflet <http://www.nxp.com/documents/leaflet/75016950.pdf> PCA9685 <https://www.nxp.com/docs/en/data-sheet/PCA9685.pdf> Vendor(s): Digikey: 568-5931-1-ND <https://www.digikey.com/product-detail/en/nxp-usa-inc/PCA9685PW-Q900118/568-5931-1-ND/2531218>

## Board
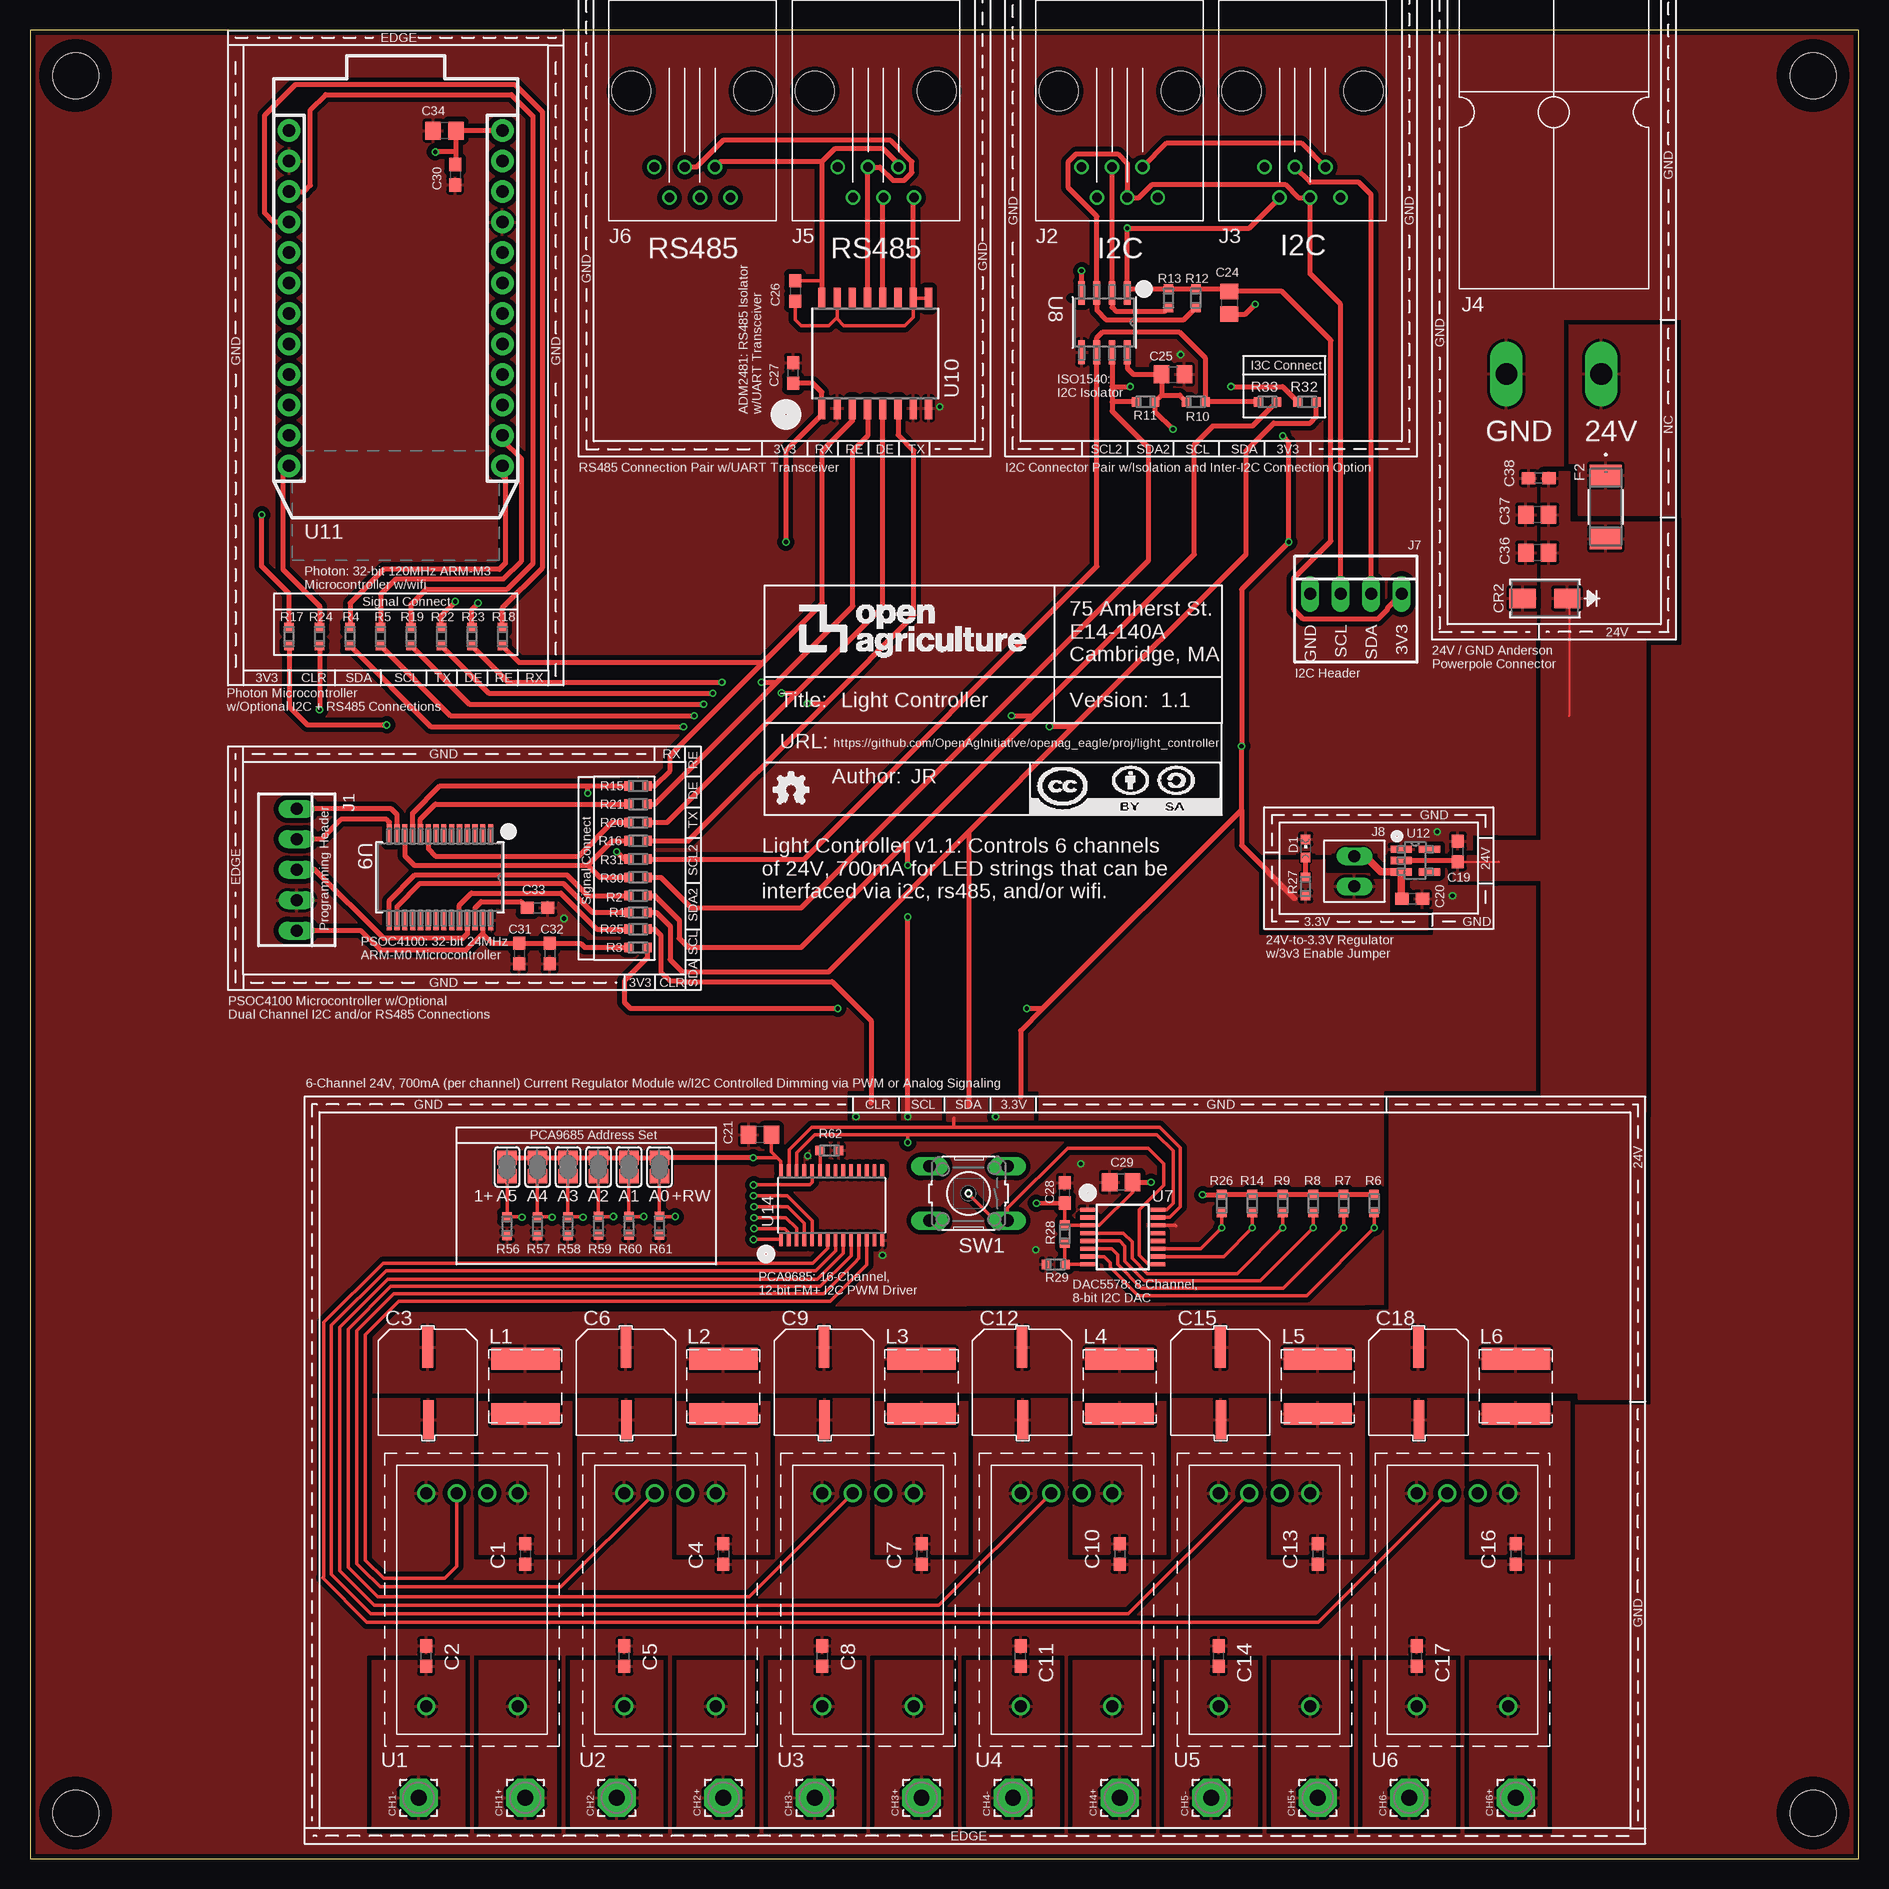
[diagram p2: board, top side]
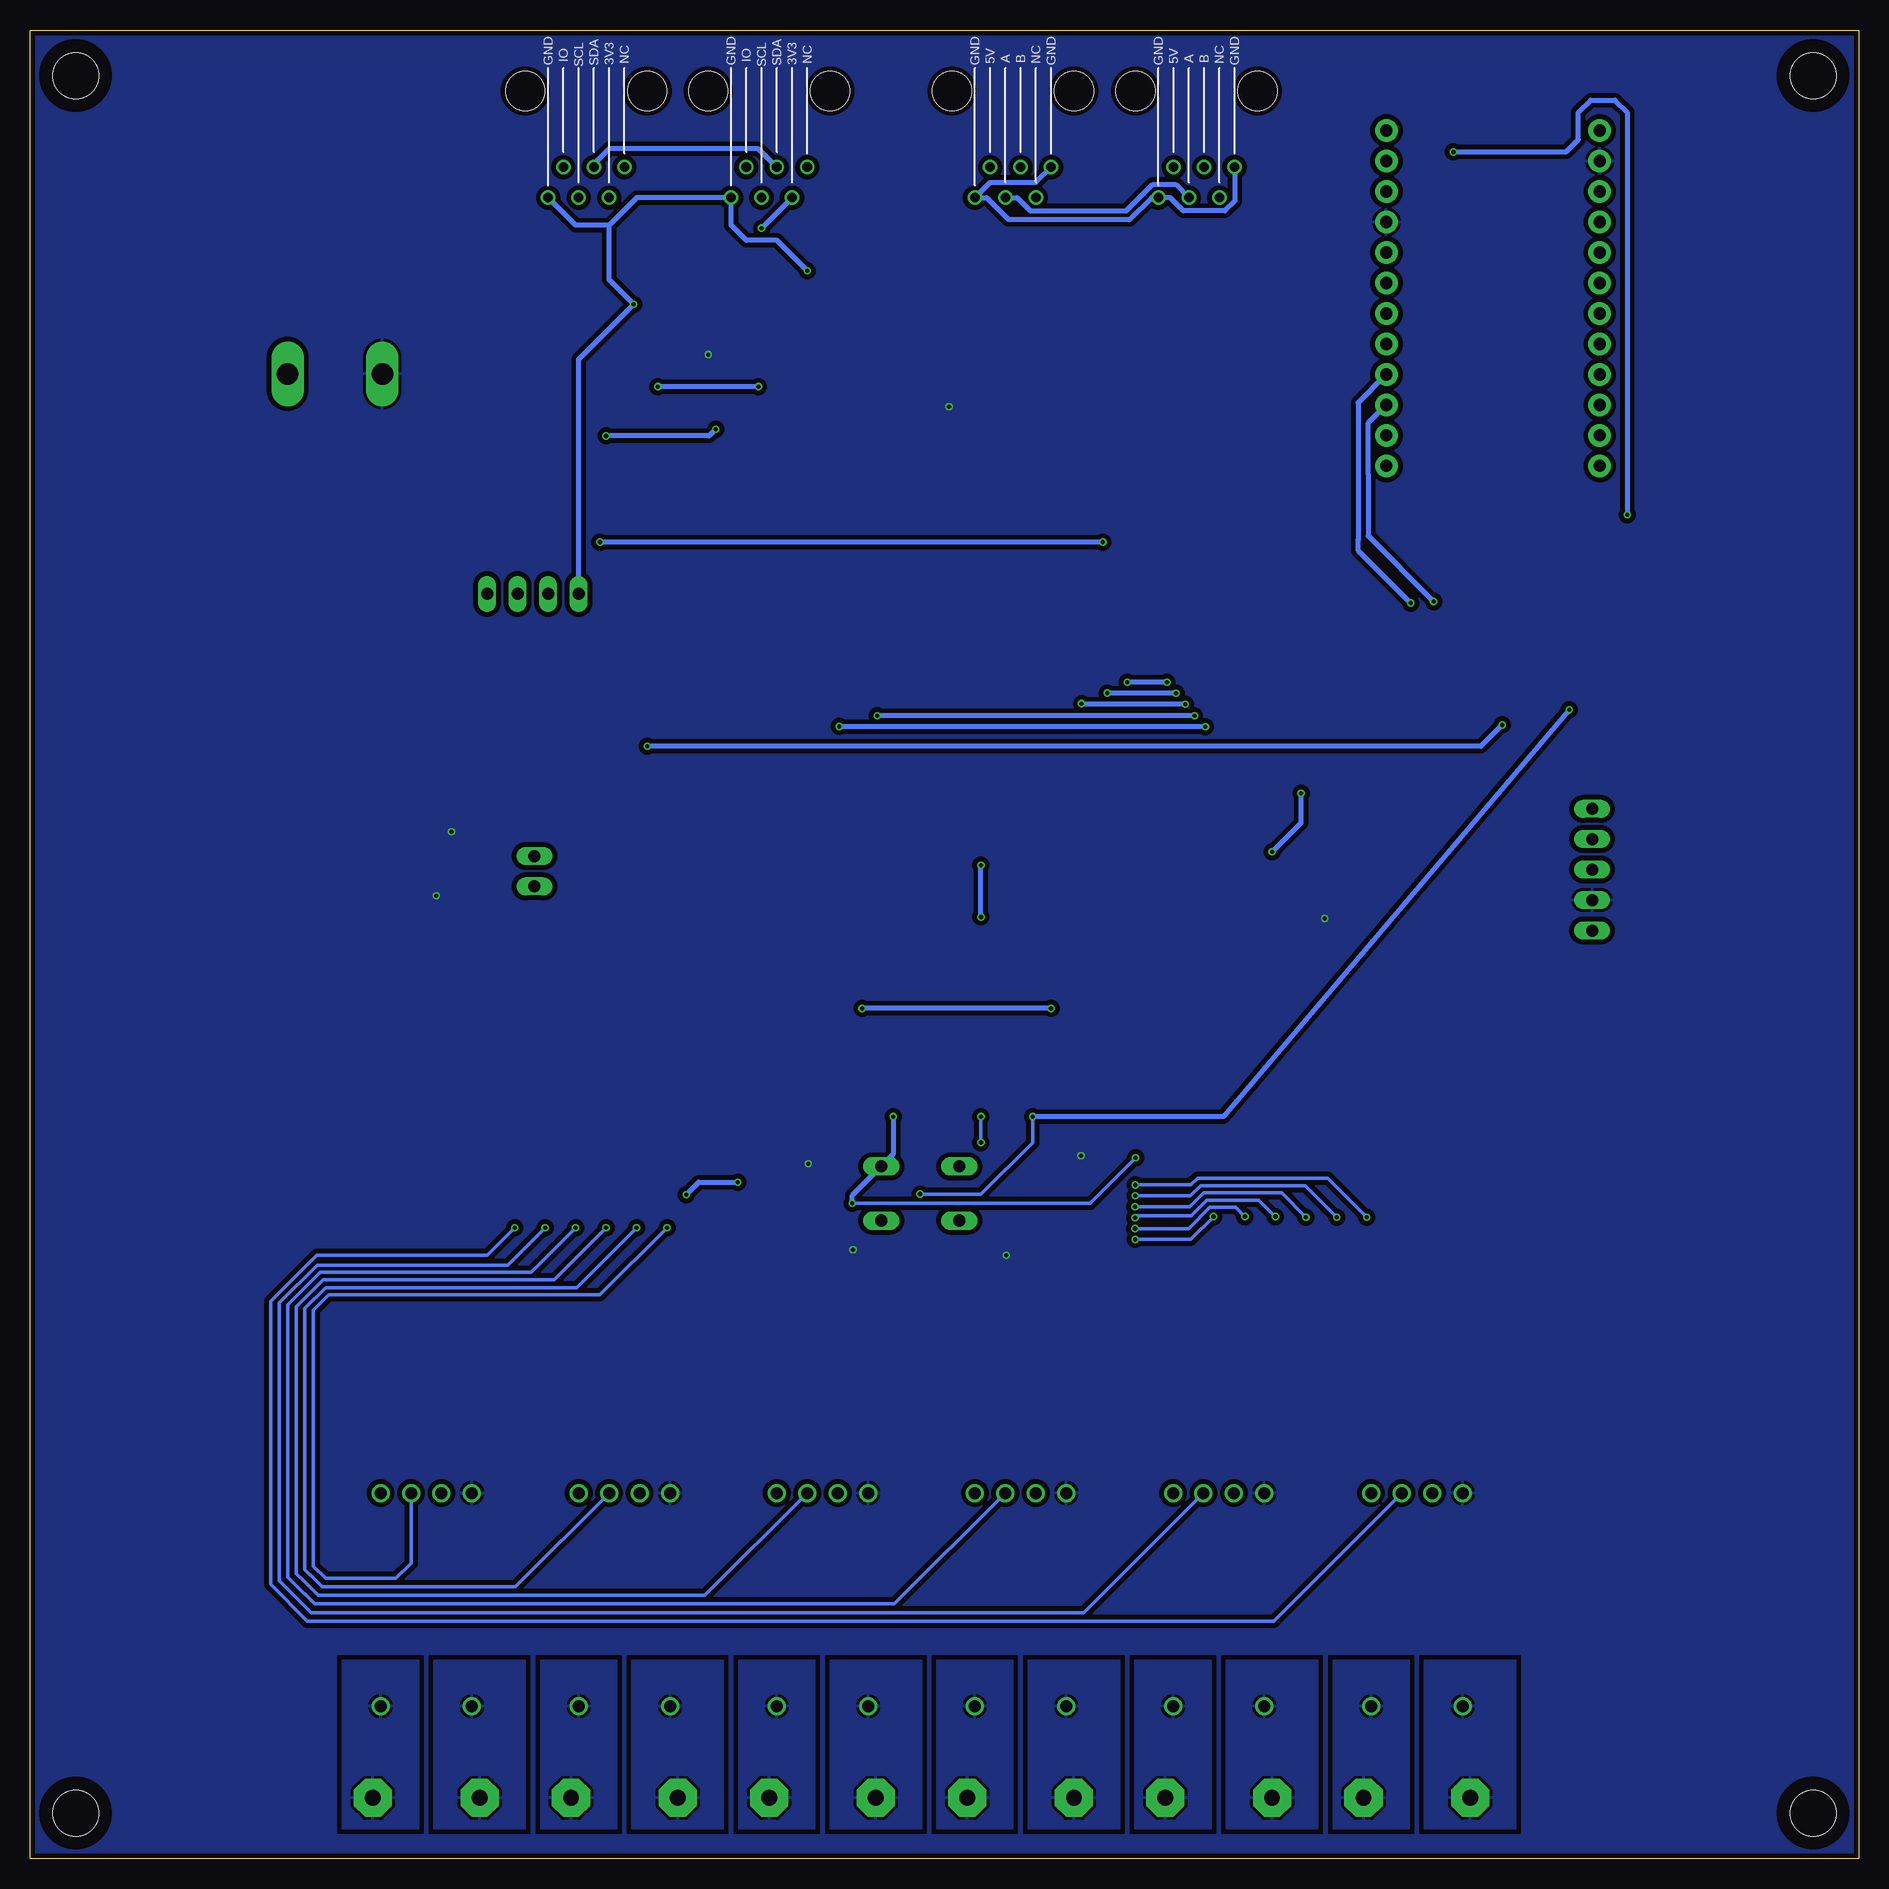
[diagram p3: board, bottom side, seen from below]

Size 152.4 x 152.4 mm. Coordinates in mm from the lower left corner, seen from the top.
Outline: 0,0 152.4,0 152.4,152.4 0,152.4 0,0
Copper layers (1*16): Top 0.035559375mm / dielectric 1.6mm / Bottom 0.035559375mm
Design rules "oshpark-2layer-mask": minimum track width 6mil, minimum drill 10mil, track to track 6mil, track to pad 6mil, pad to pad 6mil, via to via 6mil, smd to smd 6mil, copper to edge 15mil, drill to drill 6mil, minimum pad ring 5mil, minimum via ring 5mil, stop-mask expansion 2.5mil, vias tented up to drill 20mil, thermal gap 10mil
tRestrict: 1 lines

### Footprints (pad centres in the part's own frame; a part is rotated, then mirrored left to right if it is on the bottom)
C0603 = smd 1.1 x 1: 1 -0.85,0; 2 0.85,0
EEE-1HA101UP = smd 0.889 x 3.404: + 0,-3.251 | smd 0.889 x 3.251: - -0.051,2.794
C0805 = smd 1.3 x 1.5: 1 -0.95,0; 2 0.95,0
3,17/1,3 = drill 1.321 pad 3.175 octagon: 1 0,0
SMA = smd 2.18 x 1.63: 1 -1.857,0; 2 1.857,0
CHIPLED_0603 = smd 0.8 x 0.8: A 0,-0.75; C 0,0.75
SS = smd 1.803 x 2.642: 1 -2.629,0; 2 2.629,0
22-23-2051 = drill 1 long: 1 -5.08,0; 2 -2.54,0; 3 0,0; 4 2.54,0; 5 5.08,0
OPENAG-I2C-RJ12 = drill 0.8: 1 -8.89,-3.175; 2 -6.35,-1.905; 3 -8.89,-0.635; 4 -6.35,0.635; 5 -8.89,1.905; 6 -6.35,3.175 | hole 3.25: 0,-5.08; 0,5.08
1377G2 = drill 1.8 long: BLK -3.95,-7.1; RED 3.95,-7.1
OPENAG-RS485-RJ12 = drill 0.8: 1 -8.89,-3.175; 2 -6.35,-1.905; 3 -8.89,-0.635; 4 -6.35,0.635; 5 -8.89,1.905; 6 -6.35,3.175 | hole 3.25: 0,-5.08; 0,5.08
OPENAG-I2C-HEADER = drill 1 long: 3V3 3.81,0; GND -3.81,0; SCL -1.27,0; SDA 1.27,0
1X2-100-MIL-HEADER = drill 1 long: 1 -1.27,0; 2 1.27,0
74404064121 = smd 1.8 x 5.7: 1 -2.3,0; 2 2.3,0
RC0603N = smd 0.756 x 0.8: 1 -0.778,0; 2 0.778,0
SOLDERJUMPER_REFLOW_NOPASTE = smd 1.168 x 1.6: 1 -0.762,0; 2 0.762,0
B3F-10XX = drill 1.016 long: 1 -3.251,2.261; 2 3.251,2.261; 3 -3.251,-2.261; 4 3.251,-2.261
RCD-24-PINNED = drill 1: 1 0,0; 2 0,-2.54; 3 0,-5.08; 4 0,-7.62; 5 17.78,-7.62; 6 17.78,0
TSSOP16 = smd 0.35 x 1.2: 1 -2.275,-2.925; 2 -1.625,-2.925; 3 -0.975,-2.925; 4 -0.325,-2.925; 5 0.325,-2.925; 6 0.975,-2.925; 7 1.625,-2.925; 8 2.275,-2.925; 9 2.275,2.925; 10 1.625,2.925; 11 0.975,2.925; 12 0.325,2.925; 13 -0.325,2.925; 14 -0.975,2.925; 15 -1.625,2.925; 16 -2.275,2.925
D8 = smd 1.981 x 0.559: 1 -2.464,1.905; 2 -2.464,0.635; 3 -2.464,-0.635; 4 -2.464,-1.905; 5 2.464,-1.905; 6 2.464,-0.635; 7 2.464,0.635; 8 2.464,1.905
SSOP-28 = smd 1.651 x 0.432: 1 -3.581,4.225; 2 -3.581,3.575; 3 -3.581,2.925; 4 -3.581,2.275; 5 -3.581,1.625; 6 -3.581,0.975; 7 -3.581,0.325; 8 -3.581,-0.325; 9 -3.581,-0.975; 10 -3.581,-1.625; 11 -3.581,-2.275; 12 -3.581,-2.925; 13 -3.581,-3.575; 14 -3.581,-4.225; 15 3.581,-4.225; 16 3.581,-3.575; 17 3.581,-2.925; 18 3.581,-2.275; 19 3.581,-1.625; 20 3.581,-0.975; 21 3.581,-0.325; 22 3.581,0.325; 23 3.581,0.975; 24 3.581,1.625; 25 3.581,2.275; 26 3.581,2.925; 27 3.581,3.575; 28 3.581,4.225
SOIC16LWB = smd 0.6 x 1.8: 1 -4.445,-4.575; 2 -3.175,-4.575; 3 -1.905,-4.575; 4 -0.635,-4.575; 5 0.635,-4.575; 6 1.905,-4.575; 7 3.175,-4.575; 8 4.445,-4.575; 9 4.445,4.575; 10 3.175,4.575; 11 1.905,4.575; 12 0.635,4.575; 13 -0.635,4.575; 14 -1.905,4.575; 15 -3.175,4.575; 16 -4.445,4.575
PHOTON = drill 1.016 pad 1.88: 1 1.27,32.258; 2 1.27,29.718; 3 1.27,27.178; 4 1.27,24.638; 5 1.27,22.098; 6 1.27,19.558; 7 1.27,17.018; 8 1.27,14.478; 9 1.27,11.938; 10 1.27,9.398; 11 1.27,6.858; 12 1.27,4.318; 13 19.05,4.318; 14 19.05,6.858; 15 19.05,9.398; 16 19.05,11.938; 17 19.05,14.478; 18 19.05,17.018; 19 19.05,19.558; 20 19.05,22.098; 21 19.05,24.638; 22 19.05,27.178; 23 19.05,29.718; 24 19.05,32.258
DBV5-M = smd 1.778 x 0.61: 1 -1.168,0.95; 2 -1.168,0; 3 -1.168,-0.95; 4 1.168,-0.95; 5 1.168,0.95
TSSOP28 = smd 0.305 x 0.991: 1 -4.225,-2.918; 2 -3.575,-2.918; 3 -2.925,-2.918; 4 -2.275,-2.918; 5 -1.625,-2.918; 6 -0.975,-2.918; 7 -0.325,-2.918; 8 0.325,-2.918; 9 0.975,-2.918; 10 1.625,-2.918; 11 2.275,-2.918; 12 2.925,-2.918; 13 3.575,-2.918; 14 4.225,-2.918; 15 4.225,2.918; 16 3.575,2.918; 17 2.925,2.918; 18 2.275,2.918; 19 1.625,2.918; 20 0.975,2.918; 21 0.325,2.918; 22 -0.325,2.918; 23 -0.975,2.918; 24 -1.625,2.918; 25 -2.275,2.918; 26 -2.925,2.918; 27 -3.575,2.918; 28 -4.225,2.918
OPENAG-CORNER-MOUNTING-HOLE = hole 3.81: 0,0

### Placement (x,y rotation side)
C1  41.27,25.4 270 top
C2  33.02,16.89 90 top
C3  33.15,39.37 180 top
C4  57.78,25.4 270 top
C5  49.53,16.89 90 top
C6  49.66,39.37 180 top
C7  74.3,25.4 270 top
C8  66.04,16.89 90 top
C9  66.17,39.37 180 top
C10  90.81,25.4 270 top
C11  82.55,16.89 90 top
C12  82.68,39.37 180 top
C13  107.31,25.4 270 top
C14  99.06,16.89 90 top
C15  99.19,39.37 180 top
C16  123.83,25.4 270 top
C17  115.57,16.89 90 top
C18  115.7,39.37 180 top
C19  119,83.95 90 top
C20  115.19,80.01 0 top
C21  60.83,60.33 180 top
C24  99.95,129.67 270 top
C25  95.25,123.7 0 top
C26  63.75,130.66 270 top
C27  63.6,123.83 90 top
C28  86.23,55.5 90 top
C29  90.93,56.39 180 top
C30  35.43,140.34 270 top
C31  40.77,75.44 270 top
C32  43.31,75.44 270 top
C33  42.29,79.25 0 top
C34  34.54,144.02 180 top
C36  125.6,108.84 180 top
C37  125.6,112.01 180 top
C38  125.73,115.06 180 top
CH1+  41.27,5.08 90 top
CH1-  32.38,5.08 90 top
CH2+  57.78,5.08 90 top
CH2-  48.9,5.08 90 top
CH3+  74.3,5.08 90 top
CH3-  65.41,5.08 90 top
CH4+  90.81,5.08 90 top
CH4-  81.92,5.08 90 top
CH5+  107.31,5.08 90 top
CH5-  98.42,5.08 90 top
CH6+  123.83,5.08 90 top
CH6-  114.94,5.08 90 top
CR2  126.24,105.03 180 top
D1  106.3,84.2 0 top
F2  131.32,112.65 270 top
FRAME1  61.21,87 0 top
J1  22.23,82.42 270 top
J2  90.81,147.32 90 top
J3  106.05,147.32 90 top
J4  126.99,130.85 0 top
J5  70.48,147.32 90 top
J6  55.19,147.32 90 top
J7  110.49,105.41 0 top
J8  110.36,82.3 270 top
L1  41.27,39.37 270 top
L2  57.78,39.37 270 top
L3  74.3,39.37 270 top
L4  90.81,39.37 270 top
L5  107.31,39.37 270 top
L6  123.83,39.37 270 top
R1  50.67,78.87 0 top
R2  50.67,80.26 0 top
R3  50.67,75.95 180 top
R4  26.67,101.85 270 top
R5  29.21,101.85 270 top
R6  112.01,54.61 270 top
R7  109.47,54.61 270 top
R8  106.93,54.61 270 top
R9  104.39,54.61 270 top
R10  97.16,121.41 180 top
R11  92.96,121.41 0 top
R12  97.16,130.05 90 top
R13  94.87,130.05 90 top
R14  101.85,54.61 270 top
R15  50.67,89.41 0 top
R16  50.67,84.84 0 top
R17  21.59,101.85 270 top
R18  39.37,101.85 270 top
R19  31.75,101.85 270 top
R20  50.67,86.36 0 top
R21  50.67,87.88 0 top
R22  34.29,101.85 270 top
R23  36.83,101.85 270 top
R24  24.13,101.85 270 top
R25  50.67,77.47 0 top
R26  99.31,54.61 270 top
R27  106.3,81.03 270 top
R28  86.23,52.07 90 top
R29  85.47,49.53 0 top
R30  50.67,81.79 0 top
R31  50.67,83.31 0 top
R32  106.43,121.41 0 top
R33  103.12,121.41 0 top
R56  39.75,52.71 90 top
R57  42.29,52.71 90 top
R58  44.83,52.71 90 top
R59  47.37,52.75 90 top
R60  49.91,52.75 90 top
R61  52.45,52.75 90 top
R62  66.61,59.03 0 top
SJ_A0  52.45,57.65 270 top
SJ_A1  49.91,57.65 270 top
SJ_A2  47.37,57.65 270 top
SJ_A3  44.83,57.65 270 top
SJ_A4  42.29,57.65 270 top
SJ_A5  39.75,57.65 270 top
SW1  78.21,55.45 180 top
U1  40.64,30.48 270 top
U2  57.15,30.48 270 top
U3  73.66,30.48 270 top
U4  90.17,30.48 270 top
U5  106.68,30.48 270 top
U6  123.19,30.48 270 top
U7  91.06,51.82 270 top
U8  89.53,128.02 270 top
U9  34.16,81.79 270 top
U10  70.43,125.45 0 top
U11  20.32,111.76 0 top
U12  115.44,83.19 0 top
U14  66.8,54.46 0 top
U$1  [OPENAG-CORNER-MOUNTING-HOLE]  3.81,3.81 0 top
U$2  [OPENAG-CORNER-MOUNTING-HOLE]  148.59,3.81 90 top
U$3  [OPENAG-CORNER-MOUNTING-HOLE]  148.59,148.59 180 top
U$4  [OPENAG-CORNER-MOUNTING-HOLE]  3.81,148.59 270 top

### Tracks (layer width: path | path; a pad name or v marks a point on that pad's centre or on a via)
2.6V
  Top 0.305: R28.1 86.25,51.28 R29.2 U7.8
24V_IN
  pour Top (isolate 0.406): 137.16,127.76 128.27,127.76 128.27,116.33 129.03,116.33 129.03,112.01 137.16,112.01
485_5V
  Top 0.305: C26.1 65.92,131.51 65.99,131.57
  Top 0.406: J5.2 72.39,141.22 71.12,142.49 67.06,142.49 65.99,141.43 | 65.99,141.43 65.99,131.57 U10.16 | 65.99,141.43 57.56,141.43 J6.2
485_A
  Top 0.305: 70.99,129.71 U10.12
  Top 0.406: U10.12 71.07,138.38 J5.3
  Bottom 0.406: J5.3 70.15,138.43 69.04,137.32 61.04,137.32 58.83,139.54 56.94,139.54 J6.3
485_B
  Top 0.305: 69.72,129.97 U10.13
  Top 0.406: U10.13 69.8,140.92 J5.4 70.82,140.97 71.93,139.86 72.85,139.86 73.5,140.51 73.5,141.43 71.72,143.21 57.77,143.21 55.53,140.97 J6.4
485_GND
  Top 0.305: U10.9 U10.10 73.61,128.47 72.9,127.76 67.82,127.76 67.26,128.32 U10.15 67.26,128.47 66.55,127.76 64.26,127.76 63.75,128.27 C26.2
  Top 0.406: U10.10 73.61,138.38 J5.1
  Bottom 0.406: J5.6 68.58,139.7 72.39,139.7 J5.1 72.69,138.43 70.87,136.61 60.75,136.61 58.93,138.43 J6.1 57.4,138.43 56.29,137.32 52.83,137.32 52.02,138.13 J6.6
+3V3  (via drill 0.35)
  Top 0.305: C28.1 R28.2 86.29,52.79 U7.3 89.11,52.79 91.88,55.56 C29.1 | U14.28 62.58,58.12 62.28,58.42 | SJ_A0.1 | 62.28,58.42 v60.27,58.42 | C21.1 61.78,58.92 62.28,58.42
  Top 0.356: C28.1 83.88,54.65 v83.87,54.63
  Top 0.406: R6.1 R7.1 R8.1 R9.1 R14.1 R26.1 99.27,55.35 v97.71,55.35 | 39.72,58.45 SJ_A5.1 SJ_A4.1 SJ_A3.1 SJ_A2.1 SJ_A1.1 SJ_A0.1 v60.27,58.41 v60.27,58.42 | C29.1 v93.42,56.39 | C27.1 65.24,122.97 65.99,122.22 U10.1 65.99,120.34 62.99,117.35 v62.99,109.73 | U8.8 91.44,124.21 91.95,123.7 C25.1 94.3,121.97 | 94.3,121.97 R11.2 93.74,120.63 v95.25,119.13 | 94.3,121.97 95.82,121.97 R10.2 | v104.39,118.57 104.9,118.06 v104.9,109.73 100.97,105.79 v100.97,92.71 100.97,87.43 | R3.1 51.45,75.07 49.53,73.15 49.53,71.37 50.04,70.87 v67.31,70.87 | v83.06,70.87 84.33,70.87 84.37,70.83 | R17.2 21.59,96.01 23.11,94.49 v29.72,94.49 | 84.37,70.83 100.97,87.43 | 100.97,87.43 100.97,84.45 105.41,80.01 | 84.37,70.83 82.55,69.01 82.55,63.5
  Bottom 0.305: v60.27,58.42 64.06,54.63 v83.87,54.63
  Bottom 0.406: v83.87,54.63 83.87,55.3 SW1.3 80.47,58.7 v80.47,61.85 | v95.25,119.13 95.81,118.57 v104.39,118.57 | v67.31,70.87 v83.06,70.87 | v62.99,109.73 v104.9,109.73 | v29.72,94.49 31.5,92.71 v100.97,92.71 | v93.42,56.39 96.67,56.39 v97.71,55.35
  pour Top (isolate 0.406): 80.26,63.5 83.57,63.5 83.57,61.21 80.26,61.21
  pour Top: 102.87,83.19 102.87,77.47 116.46,77.47 116.46,78.74 113.28,78.74 113.28,81.53 111.63,81.53 111.63,82.04 107.95,82.04 107.95,83.19
+24V
  Top 0.152: CR2.1 128.27,105.03 128.27,95.25 | C19.1 122.39,83.1 122.43,83.06
  Top 0.406: U12.2 118.91,83.19 C19.1 119.09,83.19
  pour Top (isolate 0.406): 128.27,38.86 128.27,45.72 28.57,45.47 28.57,38.86
  pour Top (isolate 0.406): 125.98,115.57 128.27,115.57 128.27,111.38 137.16,111.38 137.16,101.6 125.98,101.6
  pour Top (isolate 0.406): 121.92,84.84 120.65,84.84 120.65,83.57 118.62,83.57 118.62,81.53 121.92,81.53
  pour Top (isolate 0.406): 113.28,63.5 113.28,38.86 129.03,38.86 129.03,38.35 134.62,38.35 134.62,63.5
  pour Top (isolate 0.406): 134.62,62.23 125.98,62.23 125.98,102.74 134.62,102.74
  pour Top: 121.16,84.84 126.75,84.84 126.75,81.53 121.16,81.53
A0  (via drill 0.35)
  Top 0.305: SJ_A0.2 R61.2 v53.77,53.52 | U14.1 62.5,51.61 v60.3,51.61
  Bottom 0.305: v60.3,51.61 55.68,51.61 v53.77,53.52
A1  (via drill 0.35)
  Top 0.305: SJ_A1.2 R60.2 v51.15,53.52 v51.16,53.52 | U14.2 63.23,52.18 62.89,52.52 v60.33,52.52
  Bottom 0.305: v60.33,52.52 55.84,52.52 54.09,54.28 51.91,54.28 v51.16,53.52
A2  (via drill 0.35)
  Top 0.305: SJ_A2.2 R59.2 v48.61,53.52 v48.62,53.52 | U14.3 63.88,52.53 62.98,53.43 v60.33,53.43
  Bottom 0.305: v60.33,53.43 60.17,53.58 55.65,53.58 54.34,54.89 49.98,54.89 v48.62,53.52
A3  (via drill 0.35)
  Top 0.305: SJ_A3.2 R58.2 46.05,53.49 v46.08,53.47 | U14.4 64.53,52.95 63.14,54.34 v60.33,54.34
  Bottom 0.305: v60.33,54.34 55.75,54.34 54.59,55.5 48.1,55.5 v46.08,53.47
A4  (via drill 0.35)
  Top 0.305: SJ_A4.2 R57.2 | R57.2 42.39,53.39 | R57.2 43.48,53.49 v43.51,53.47 | U14.5 65.18,53.16 63.09,55.25 v60.3,55.25
  Bottom 0.305: v60.3,55.25 55.7,55.25 54.84,56.11 46.15,56.11 v43.51,53.47
A5  (via drill 0.35)
  Top 0.254: 39.58,53.49 R56.2
  Top 0.305: 65.18,56.69 U14.24 65.18,56.36 64.97,56.16 v60.3,56.16 | SJ_A5.2 39.75,53.66 39.58,53.49 | 39.85,53.39 R56.2 40.97,53.49 v41,53.47
  Bottom 0.305: v60.3,56.16 55.66,56.16 55.1,56.72 44.24,56.72 v41,53.47
CH1+
  pour Bottom (isolate 0.406): 37.47,2.54 37.47,16.51 43.81,16.51 43.81,2.54
  pour Top (isolate 0.406): 37.47,2.54 37.47,16.51 43.81,16.51 43.81,2.54
CH1-
  pour Top (isolate 0.406): 28.57,2.54 28.57,16.51 36.2,16.51 36.2,2.54
  pour Bottom (isolate 0.406): 28.57,2.54 28.57,16.51 36.2,16.51 36.2,2.54
CH2+
  pour Bottom (isolate 0.406): 53.98,2.54 53.98,16.51 60.33,16.51 60.33,2.54
  pour Top (isolate 0.406): 53.98,2.54 53.98,16.51 60.33,16.51 60.33,2.54
CH2-
  pour Top (isolate 0.406): 45.09,2.54 45.09,16.51 52.7,16.51 52.7,2.54
  pour Bottom (isolate 0.406): 45.09,2.54 45.09,16.51 52.7,16.51 52.7,2.54
CH3+
  pour Bottom (isolate 0.406): 70.48,2.54 70.48,16.51 76.83,16.51 76.83,2.54
  pour Top (isolate 0.406): 70.48,2.54 70.48,16.51 76.83,16.51 76.83,2.54
CH3-
  pour Top (isolate 0.406): 61.59,2.54 61.59,16.51 69.22,16.51 69.22,2.54
  pour Bottom (isolate 0.406): 61.59,2.54 61.59,16.51 69.22,16.51 69.22,2.54
CH4+
  pour Bottom (isolate 0.406): 87,2.54 87,16.51 93.34,16.51 93.34,2.54
  pour Top (isolate 0.406): 87,2.54 87,16.51 93.34,16.51 93.34,2.54
CH4-
  pour Top (isolate 0.406): 78.11,2.54 78.11,16.51 85.72,16.51 85.72,2.54
  pour Bottom (isolate 0.406): 78.11,2.54 78.11,16.51 85.72,16.51 85.72,2.54
CH5+
  pour Bottom (isolate 0.406): 103.5,2.54 103.5,16.51 109.86,16.51 109.86,2.54
  pour Top (isolate 0.406): 103.5,2.54 103.5,16.51 109.86,16.51 109.86,2.54
CH5-
  pour Top (isolate 0.406): 94.61,2.54 94.61,16.51 102.23,16.51 102.23,2.54
  pour Bottom (isolate 0.406): 94.61,2.54 94.61,16.51 102.23,16.51 102.23,2.54
CH6+
  pour Bottom (isolate 0.406): 120.02,2.54 120.02,16.51 126.36,16.51 126.36,2.54
  pour Top (isolate 0.406): 120.02,2.54 120.02,16.51 126.36,16.51 126.36,2.54
CH6-
  pour Top (isolate 0.406): 111.12,2.54 111.12,16.51 118.75,16.51 118.75,2.54
  pour Bottom (isolate 0.406): 111.12,2.54 111.12,16.51 118.75,16.51 118.75,2.54
DAC_!CLR!  (via drill 0.35)
  Top 0.305: U7.9 93.97,49.56 93.19,49.56 92.46,50.3 92.46,54.1 94.49,56.13 94.49,57.91 93.17,59.23 86.46,59.23 81.46,54.23 81.46,53.34 | 81.46,53.34 SW1.1 | v78.23,55.4 80.29,53.34 81.46,53.34
  Top 0.356: 94.37,49.54 U7.9
  Top 0.406: R25.2 52.07,77.47 52.58,76.96 52.58,73.91 53.34,73.15 53.97,73.15 54.02,73.1 66.85,73.1 70.1,69.85 70.1,62.99 | R24.2 v24.13,95.76
  Bottom 0.305: v68.83,61.85 68.83,59.69 73.15,55.37 78.21,55.37 v78.23,55.4
  Bottom 0.406: v24.13,95.76 52.96,61.85 v68.83,61.85
  pour Top (isolate 0.406): 72.14,63.5 68.58,63.5 68.58,61.47 72.14,61.47
DIM1  (via drill 0.35)
  Top 0.305: R6.2 v112.01,52.58 106.38,46.94 92.37,46.94 90.02,49.29 90.02,49.68 89.51,50.19 U7.7
  Top 0.356: 88.09,50.15 U7.7
  Bottom 0.305: U1.2 48.77,19.81 129.28,19.81 132.33,22.87 132.33,46.48 128.52,50.29 114.3,50.29 v112.01,52.58
DIM2  (via drill 0.35)
  Top 0.305: R7.2 v109.47,52.58 104.44,47.55 92.62,47.55 90.63,49.54 90.63,50.34 90.13,50.84 U7.6
  Bottom 0.305: U2.2 64.57,20.52 128.97,20.52 130.55,22.1 130.56,22.1 131.62,23.16 131.62,46.32 128.47,49.48 112.57,49.48 v109.47,52.58
DIM3  (via drill 0.35)
  Top 0.305: R8.2 v106.93,52.58 102.51,48.16 92.87,48.16 91.24,49.79 91.24,51.05 90.8,51.49 U7.5 88.12,51.47
  Bottom 0.305: U3.2 80.37,21.23 128.66,21.23 129.52,22.1 129.54,22.1 130.91,23.47 130.91,46.17 128.22,48.87 110.64,48.87 v106.93,52.58
DIM4  (via drill 0.35)
  Top 0.305: R9.2 v104.39,52.58 100.58,48.77 93.12,48.77 91.85,50.05 91.85,51.41 91.11,52.14 U7.4
  Bottom 0.305: U4.2 96.16,21.95 128.36,21.95 129.53,23.11 129.54,23.11 130.2,23.77 130.2,46.02 127.96,48.26 108.71,48.26 v104.39,52.58
DIM5  (via drill 0.35)
  Top 0.305: R14.2 v101.85,52.58 99.47,50.19 U7.10
  Bottom 0.305: U5.2 111.96,22.66 128.06,22.66 129.02,23.62 129.03,23.62 129.49,24.08 129.49,45.87 127.76,47.6 106.83,47.6 v101.85,52.58
DIM6  (via drill 0.35)
  Top 0.305: R26.2 v99.31,52.58 97.58,50.84 U7.11
  Bottom 0.305: U6.2 120.65,24.64 121.92,23.37 127.76,23.37 128.78,24.38 128.78,45.72 127.51,46.99 104.9,46.99 v99.31,52.58
GND  (via drill 0.35)
  Top 0.254: 47.34,51.76 R59.1
  Top 0.305: U7.14 95.44,52.79 95.48,52.76
  other vias: 75.82,121.01 64.82,58.6 71.04,50.29 87.55,57.91 83.82,50.75 95.89,125.35 44.5,78.36 118.54,80.26 117.27,85.6
  pour Top (isolate 0.406, rank 3): 0,0 152.4,0 152.4,152.4 0,152.4
  pour Bottom (isolate 0.406, rank 3): 0,0 152.4,0 152.4,152.4 0,152.4
  pour Top (isolate 0.406): 117.09,77.47 121.92,77.47 121.92,81.03 115.32,81.03 115.32,79.25 117.09,79.25
  pour Top (isolate 0.305): 125.48,101.6 116.84,101.6 116.84,156.21 137.16,156.21 137.16,128.78 127.51,128.78 127.51,116.33 125.48,116.33
  pour Top: 121.92,85.34 120.14,85.34 120.14,84.07 118.11,84.07 118.11,84.84 115.32,84.84 115.32,83.82 102.87,83.82 102.87,87.63 121.92,87.63
I2C_3V3  (via drill 0.35)
  Top 0.406: J3.5 101.6,135.89 v91.44,135.89 U8.1 91.79,130.83 R13.2 R12.2 99.74,130.83 C24.1 104.33,130.62 108.41,126.54 108.41,109.81 105.32,106.72 105.32,104.1 106.12,103.3 112.32,103.3 113.12,104.1 113.12,104.23 J7.3V3
  Bottom 0.406: J2.5 v91.44,135.89
I2C_GND  (via drill 0.35)
  Top 0.406: C24.2 101.28,128.72 v102.11,129.54 | U8.4 v87.63,132.33
  Bottom 0.406: 104.14,136.14 101.85,138.43 J2.1 93.98,136.14 92.71,134.87 90.17,134.87 v87.63,132.33 | 104.14,136.14 106.93,136.14 J3.1 | 104.14,136.14 104.14,131.57 v102.11,129.54 106.68,124.97 J7.GND
I2C_IO
  Top 0.406: J2.2 94.74,143 105.92,143 J3.2
N$1
  pour Top (isolate 0.406): 37.47,25.4 37.47,38.1 45.09,38.1 45.09,25.4
N$2
  pour Top (isolate 0.406): 53.98,25.4 53.98,38.1 61.59,38.1 61.59,25.4
N$3
  Top 0.406: R27.1 D1.A
N$4
  pour Top (isolate 0.406): 70.48,25.4 70.48,38.1 78.11,38.1 78.11,25.4
N$5
  pour Top (isolate 0.406): 87,25.4 87,38.1 94.61,38.1 94.61,25.4
N$6
  pour Top (isolate 0.406): 103.5,25.4 103.5,38.1 111.12,38.1 111.12,25.4
N$7
  pour Top (isolate 0.406): 120.02,25.4 120.02,38.1 128.27,38.1 128.27,25.4
N$8  (via drill 0.35)
  Top 0.406: U11.24 C34.1 35.49,142.24 | 35.49,142.24 35.49,141.25 C30.1 | 35.49,142.24 v33.78,142.24 | R17.1 21.59,105.41 19.3,107.7 v19.3,112.01
  Bottom 0.406: v33.78,142.24 24.38,142.24 23.37,143.26 23.37,145.54 22.35,146.56 20.32,146.56 19.3,145.54 v19.3,112.01
N$23
  Top 0.305: U9.26
  Top 0.406: U9.26 37.09,79.25 37.59,79.76 40.93,79.76 C33.1
OE
  Top 0.305: U14.23 R62.1
P0[7]
  Top 0.406: U9.24 35.79,79.48 36.78,80.47 44.25,80.47 47.24,77.47 R25.1
P2[6]
  Top 0.406: U9.9 33.19,84.16 33.78,83.57 45.72,83.57 48.51,86.36 R20.1
P2[7]
  Top 0.305: 32.51,85.39 U9.10
  Top 0.406: U9.10 32.54,86.64 33.78,87.88 R21.1
PHOTON_A0
  Top 0.406: U11.12 21.08,115.57 21.08,107.44 24.13,104.39 R24.1
PHOTON_D2  (via drill 0.35)
  Top 0.406: R22.1 34.29,103.63 v35.43,104.78
  Bottom 0.406: U11.15 40.92,119.61 40.92,115.44 40.89,115.41 40.89,110.24 v35.43,104.78
PHOTON_D3  (via drill 0.35)
  Top 0.406: R23.1 36.83,104.14 v37.34,104.65
  Bottom 0.406: v37.34,104.65 41.71,109.02 41.71,109.9 41.73,109.92 41.73,121.34 U11.16
PHOTON_RX
  Top 0.406: U11.4 20.32,136.4 19.56,137.16 19.56,145.29 22.1,147.83 40.46,147.83 42.72,145.56 42.72,107.6 39.37,104.25 R18.1
PHOTON_SCL
  Top 0.406: U11.14 39.37,118.27 40.92,116.72 40.92,108.1 39.45,106.63 30.48,106.63 29.21,105.36 R5.1
PHOTON_SDA
  Top 0.406: U11.13 39.37,115.32 39.62,115.06 39.62,107.95 39.12,107.44 29.46,107.44 26.67,104.65 R4.1
PHOTON_TX
  Top 0.406: R19.1 31.75,104.55 33.02,105.82 39.79,105.82 41.91,107.94 41.91,145.23 40.12,147.01 24.64,147.01 23.37,145.75 23.37,139.45 22.86,138.94 U11.3
PWM1
  Top 0.305: U1.3 35.56,24.38 34.54,23.37 29.46,23.37 27.94,24.89 27.94,43.69 30.73,46.48 66.7,46.48 69.73,49.51 U14.12
PWM2
  Top 0.305: U2.3 44.25,22.66 29.17,22.66 27.7,24.13 27.69,24.13 27.23,24.59 27.23,43.99 30.33,47.09 66.14,47.09 68.73,49.68 69.08,50.03 U14.11
PWM3
  Top 0.305: U3.3 59.94,21.84 28.97,21.84 26.52,24.29 26.52,44.14 30.07,47.7 65.87,47.7 68.13,49.96 | U14.10 68.43,50.26 68.13,49.96 | 68.15,49.96 68.13,49.96
PWM4
  Top 0.305: U4.3 75.74,21.13 28.67,21.13 25.81,24 25.81,44.3 29.82,48.31 65.62,48.31 67.78,50.47 U14.9
PWM5
  Top 0.305: U5.3 91.54,20.42 28.38,20.42 25.09,23.7 25.09,44.45 29.67,49.02 65.47,49.02 67.13,50.68 U14.8
PWM6
  Top 0.305: U6.3 107.34,19.71 28.08,19.71 24.38,23.41 24.49,23.51 24.49,44.7 29.42,49.63 65.21,49.63 66.48,50.9 U14.7
REG_3V3
  Top 0.406: 114.28,80.07 C20.1
  Top 0.61: 114.28,80.07 U12.3 112.58,82.23 111.25,83.57 J8.1
SCB0_I2C_SCL
  Top 0.406: U9.15 29.94,79.85 32.08,81.99 44.73,81.99 46.46,80.26 R2.1
SCB0_I2C_SDA
  Top 0.406: U9.16 30.59,79.36 32.51,81.28 44.44,81.28 46.86,78.86 R1.1
SCB1_RX[0]_SCL[0]  (via drill 0.35)
  Top 0.406: U9.11 31.89,87.13 34.16,89.41 46.48,89.41 | 46.48,89.41 R15.1 | R31.1 49.5,83.31 v48.89,83.92 | v46.48,88.8 46.48,89.41
  Bottom 0.406: v48.89,83.92 46.48,86.33 v46.48,88.8
SCB1_TX[0]_SDA[0]
  Top 0.406: U9.12 31.24,83.57 32,82.8 46.48,82.8 | R30.1 47.5,81.79 46.48,82.8 | 46.48,82.8 48.51,84.84 R16.1
SCL  (via drill 0.35)
  Top 0.305: U7.16 94.73,54.09 95.25,54.61 95.25,59 93.9,60.35 73.15,60.35 | U14.26 63.88,58.82 65.41,60.35 72.9,60.35 73.15,60.35 | 73.15,60.35 v73.15,59.69
  Top 0.406: R33.2 101.87,119.38 98.55,119.38 97.03,117.86 97.03,108.71 83.57,95.25 | R2.2 52.07,80.26 54.1,78.23 54.1,76.71 54.86,75.95 64.26,75.95 73.15,84.84 | 73.15,84.84 83.57,95.25 | R5.2 35.03,95.26 v55.36,95.26 | v81.79,95.25 83.57,95.25 | v73.15,61.85 v73.15,78.49 | v73.15,82.8 73.15,84.84
  Bottom 0.305: v73.15,59.69 v73.15,61.85
  Bottom 0.406: v55.36,95.26 81.78,95.26 v81.79,95.25 | v73.15,78.49 v73.15,82.8
  pour Top (isolate 0.406): 72.64,63.5 72.64,61.47 75.95,61.47 75.95,63.5
SCL1
  Top 0.305: U8.3 89.03,130.61
  Top 0.406: R12.1 96.16,128.27 89.66,128.27 88.9,129.03 U8.3 88.9,136.86 86.52,139.24 86.52,141.43 87.17,142.08 90.63,142.08 91.44,141.27 J2.3 92.41,138.43 93.52,139.54 104.6,139.54 105.71,138.43 J3.3 106.68,132.08 109.22,129.54 J7.SCL
SCL2
  Top 0.406: R33.1 R10.1 97.93,125.08 95.76,127.25 89.41,127.25 88.9,126.75 U8.6 88.9,107.7 64.52,83.31 R31.2
SDA  (via drill 0.35)
  Top 0.305: U7.15 94,53.46 94.96,53.46 95.86,54.36 95.86,59.26 94.16,60.96 76.96,60.96 | U14.27 63.27,57.42 63.27,59.08 65.15,60.96 76.96,60.96 | 76.96,60.96 76.96,61.72
  Top 0.406: R32.2 107.2,120.16 106.68,119.63 103.63,119.63 101.35,117.35 101.35,108.71 87,94.36 | R1.2 52.2,78.87 53.34,77.72 53.34,74.93 54.36,73.91 66.55,73.91 78.23,85.6 | 78.23,85.6 87,94.36 | R4.2 33.4,94.35 v54.45,94.35 | v84.96,94.36 87,94.36 | 78.23,85.6 78.23,62.74
  Bottom 0.406: v54.45,94.35 81.4,94.35 81.41,94.34 84.94,94.34 v84.96,94.36
  pour Top (isolate 0.406): 76.45,63.5 79.76,63.5 79.76,61.47 76.45,61.47
SDA1
  Top 0.406: J2.4 U8.2 90.17,129.29 90.47,128.98 94.58,128.98 R13.1 | J7.SDA 111.76,138.68 110.74,139.7 106.68,139.7 J3.4
  Bottom 0.406: J2.4 91.69,142.49 104.14,142.49 105.41,141.22 J3.4
SDA2  (via drill 0.35)
  Top 0.406: 90.15,125.54 U8.7 90.17,122.68 | 90.17,122.68 90.17,121.41 | 90.17,121.41 90.17,120.65 93.22,117.6 93.22,108.2 64.26,79.25 55.12,79.25 52.58,81.79 R30.2 | R11.1 90.17,121.41 | 90.17,122.68 v91.69,122.68 | v100.08,122.68 104.39,122.68 105.65,121.43 R32.1
  Bottom 0.406: v91.69,122.68 v100.08,122.68
SWD_CLK[0]
  Top 0.406: U9.14 29.94,86.39 29.72,86.61 25.91,86.61 24.26,84.96 J1.2
SWD_IO[0]
  Top 0.406: U9.13 30.59,87.01 30.1,87.5 J1.1
UART_!RE!  (via drill 0.35)
  Top 0.406: 69.85,120.83 U10.4 69.8,118.57 68.58,117.35 68.58,104.39 62.23,98.04 | R21.2 52.07,87.88 62.23,98.04 | R23.2 39.86,98.04 v57.66,98.04 | v60.96,98.04 62.23,98.04
  Bottom 0.406: v57.66,98.04 v60.96,98.04
UART_DE  (via drill 0.35)
  Top 0.406: 71.12,120.83 U10.5 71.07,104.34 63.87,97.14 | R20.2 53.09,86.36 63.87,97.14 | R22.2 38.23,97.13 v56.9,97.13 | v62.62,97.14 63.87,97.14
  Bottom 0.406: v56.9,97.13 62.61,97.13 v62.62,97.14
UART_RX
  Top 0.305: U10.3 68.58,120.83
  Top 0.406: U10.3 68.53,119.84 66.04,117.35 66.04,104.65 61.09,99.69 | R15.2 52.07,89.41 53.34,90.68 53.34,91.95 61.09,99.69 | R18.2 40.75,99.69 61.09,99.69
UART_TX  (via drill 0.35)
  Top 0.406: 72.39,120.83 U10.6 72.34,118.67 73.66,117.35 73.66,103.63 66.29,96.27 | 66.29,96.27 54.86,84.84 R16.2 | R19.2 36.6,96.22 v56.13,96.22 | v64.77,96.27 66.29,96.27
  Bottom 0.406: v56.13,96.22 64.72,96.22 v64.77,96.27
VDDD
  Top 0.406: U9.27 37.74,77.11 | J1.5 27.56,77.34 29.21,75.69 36.32,75.69 37.74,77.11 | R3.2 46.23,75.95 45.89,76.29 C32.1 C31.1 38.56,76.29 37.74,77.11
XRES
  Top 0.406: U9.25 36.44,77.08 36.07,76.71 29.46,76.71 23.75,82.42 J1.3

### Text on the board
tPlace: EDGE | EDGE | EDGE | EDGE | GND | GND | GND | I2C | RS485 | RS485 | I2C | GND | GND | GND | GND | GND | I3C Connect | ISO1540: / I2C Isolator | ADM2481: RS485 Isolator / w/UART Transceiver | NC | GND | 24V | 3V3 | RX | RE | DE | TX | SCL2 | SDA2 | SCL | SDA | 3V3 | RS485 Connection Pair w/UART Transceiver | I2C Connector Pair w/Isolation and Inter-I2C Connection Option | Photon: 32-bit 120MHz ARM-M3 / Microcontroller w/wifi | Signal Connect | 24V | 24V / GND Anderson / Powerpole Connector | 3V3 | CLR | SDA | SCL | TX | DE | RE | RX | I2C Header | Photon Microcontroller / w/Optional I2C + RS485 Connections | GND | RX | RE | DE | GND | TX | SCL2 | 24V | EDGE | Signal Connect | Light Controller v1.1: Controls 6 channels / of 24V, 700mA for LED strings that can be / interfaced via i2c, rs485, and/or wifi. | SDA2 | 3.3V | GND | Programming Header | PSOC4100: 32-bit 24MHz / ARM-M0 Microcontroller | SCL | 24V-to-3.3V Regulator / w/3v3 Enable Jumper | GND | 3V3 | CLR | SDA | PSOC4100 Microcontroller w/Optional / Dual Channel I2C and/or RS485 Connections | 6-Channel 24V, 700mA (per channel) Current Regulator Module w/I2C Controlled Dimming via PWM or Analog Signaling | GND | CLR | SCL | SDA | 3.3V | GND | PCA9685 Address Set | 24V | 1+ | A5 | A4 | A3 | A2 | A1 | A0 | +RW | PCA9685: 16-Channel, / 12-bit FM+ I2C PWM Driver | DAC5578: 8-Channel, / 8-bit I2C DAC | GND | EDGE